# Altium project e-puck3-coreboard.PrjPcb (part 2 of 4)

## Sheet Power.SchDoc: Power
size A3; Organization: Use Organization_Name in ProjParam; Address1: Eliot Ferragni; Address2: STI-MOBOTS; Address3: EPFL; Address4: CH-1015 LAUSANNE; DocumentNumber: 4; Revision: A; SheetNumber: 4; SheetTotal: 11; ApprovedBy: Init ApprovedBy in DocParam; CheckedBy: Init CheckedBy in DocParam; Author: Init Author in DocParam; CompanyName: Init CompanyName in DocParam; DrawnBy: Init DrawBy in DocParam; Engineer: Init Engineer in DocParam; Title2: Power button + 3V + 1.2V + alimentation measures; DocumentName: Init DocumentName in DocParam; ProjectName: Init ProjectName in DocParam
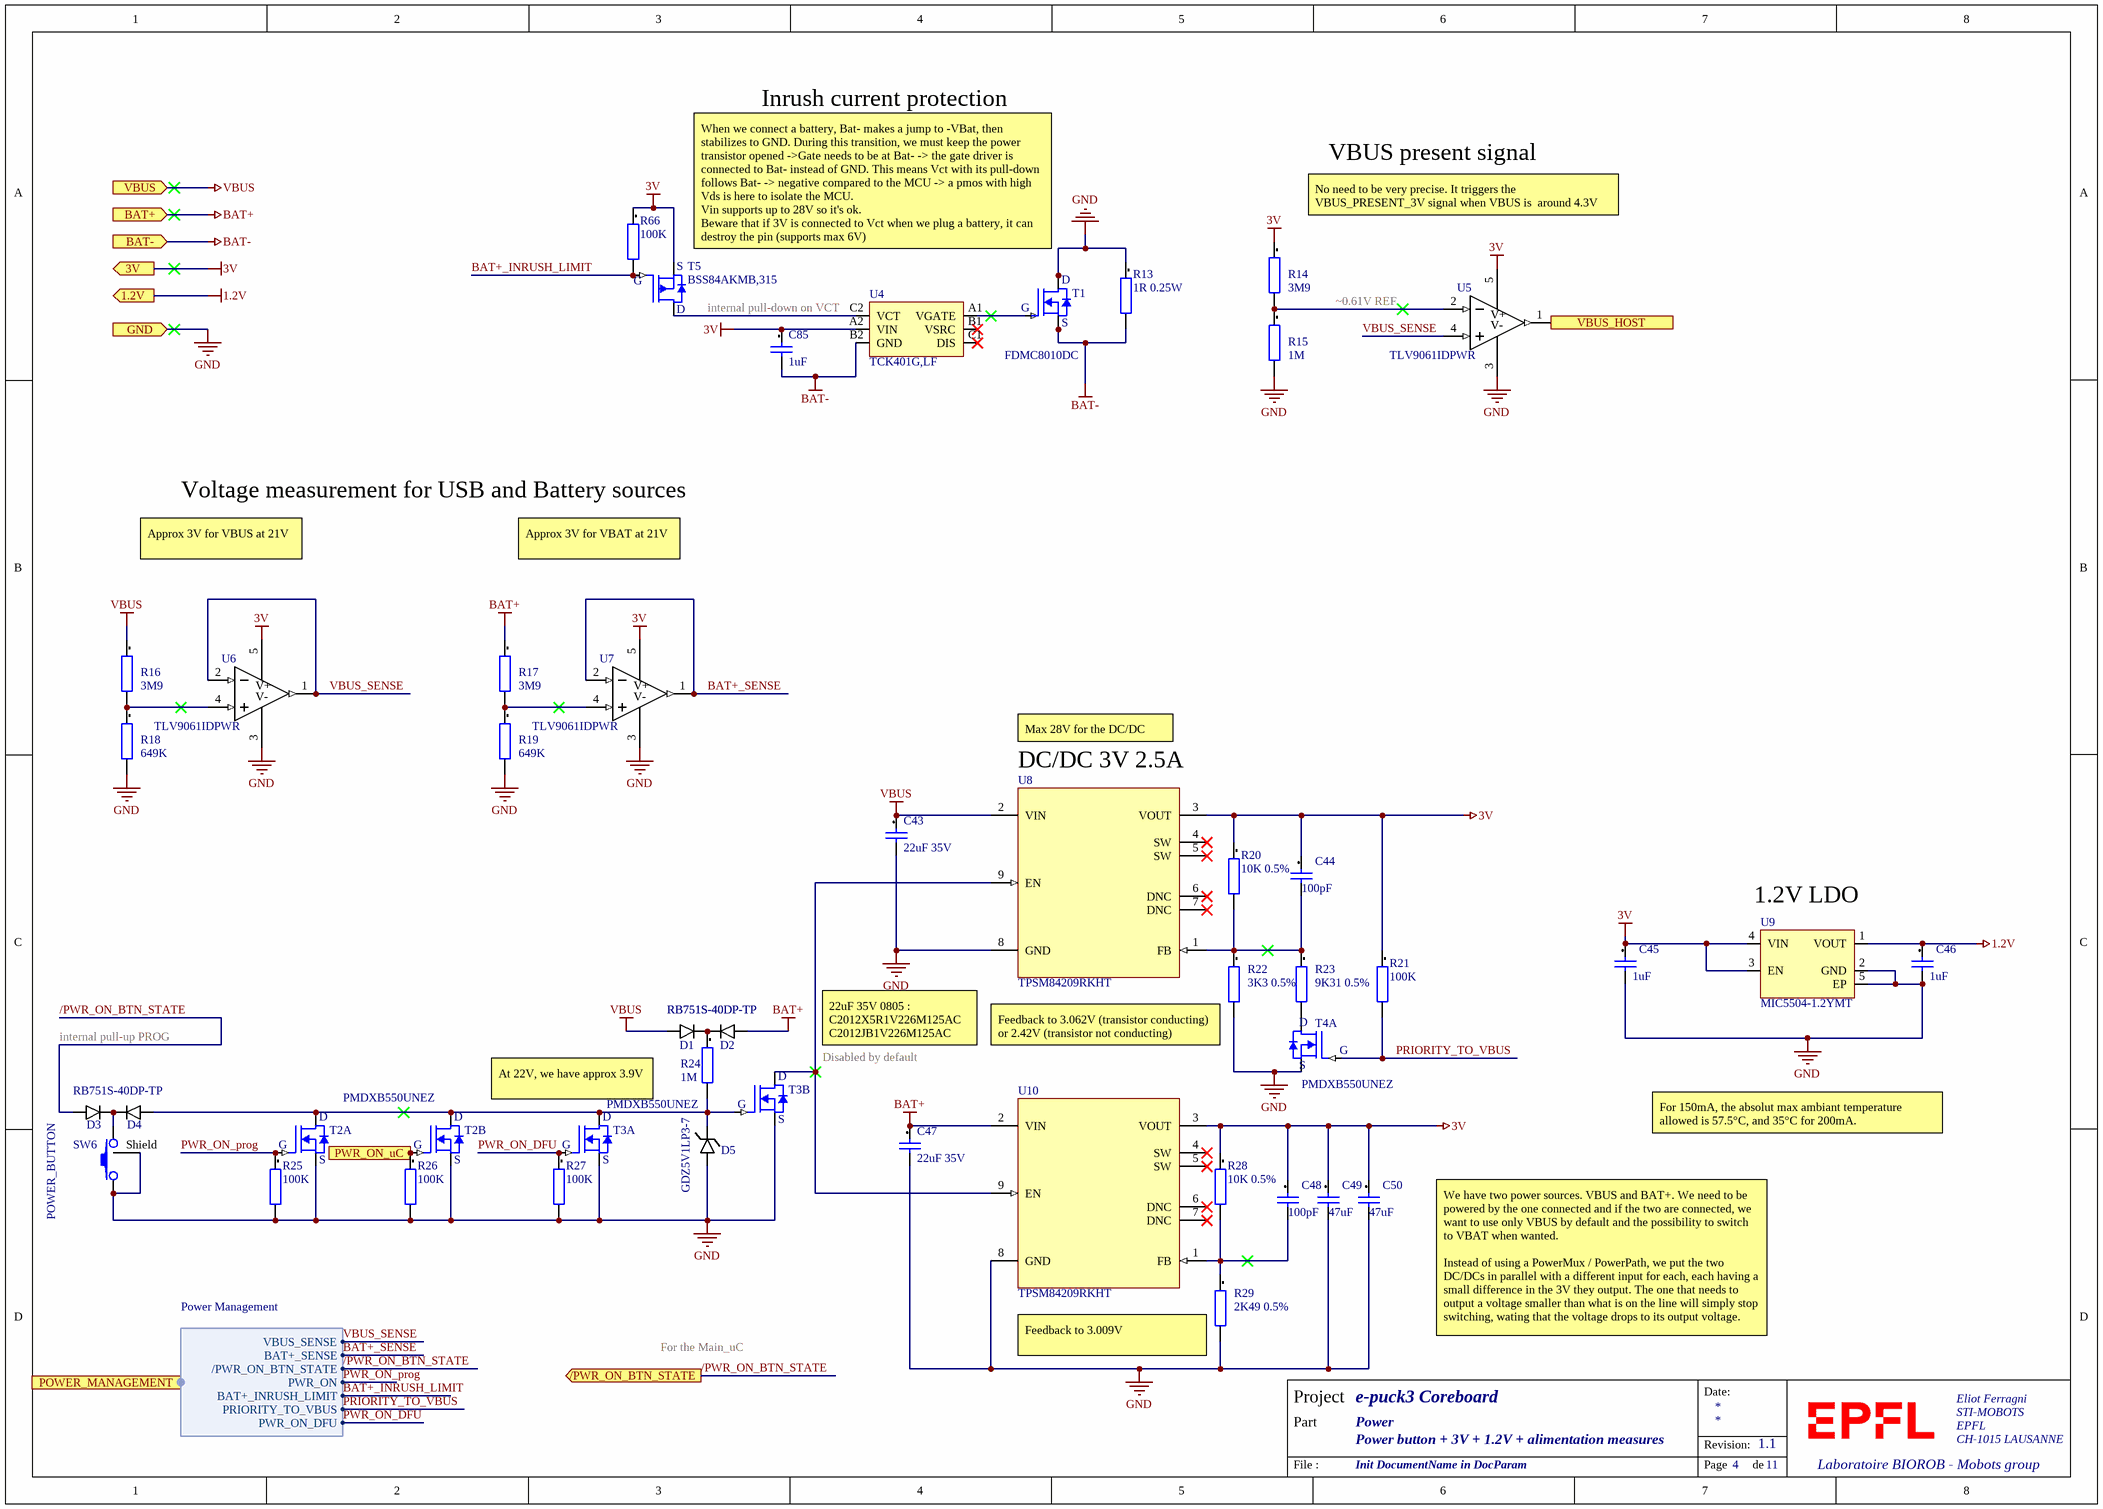
[diagram p2: Power.SchDoc]

### Parts
(Parts that share a designator on the sheet are numbered #1, #2 ... from top to bottom, then left to right.)
C43  22uF 35V  [CAPC2012X13L]
C44  100pF  [CAPC0201(0603)33_L]
C45  1uF  [CAPC0201(0603)33_L]
C46  1uF  [CAPC0201(0603)33_L]
C47  22uF 35V  [CAPC2012X13L]
C48  100pF  [CAPC0201(0603)33_L]
C49  47uF  [CAPC1608X08L]
C50  47uF  [CAPC1608X08L]
C85  1uF  [CAPC0201(0603)33_L]
D1#1  RB751S-40DP-TP  [0201 diode]
D2#1  RB751S-40DP-TP  [0201 diode]
D3#1  RB751S-40DP-TP  [0201 diode]  (value not drawn)
D4#1  RB751S-40DP-TP  [0201 diode]
D5#1  GDZ5V1LP3-7  [X3-DFN0603-2]
R13#1  1R 0.25W  [RESC1608X06L]
R14  3M9  [RESC0201(0603)_L]
R15  1M  [RESC0201(0603)_L]
R16  3M9  [RESC0201(0603)_L]
R17  3M9  [RESC0201(0603)_L]
R18  649K  [RESC0201(0603)_L]
R19  649K  [RESC0201(0603)_L]
R20  10K 0.5%  [RESC0201(0603)_L]
R21  100K  [RESC0201(0603)_L]
R22  3K3 0.5%  [RESC1005X04L]
R23  9K31 0.5%  [RESC1005X04L]
R24  1M  [RESC0201(0603)_L]
R25  100K  [RESC0201(0603)_L]
R26  100K  [RESC0201(0603)_L]
R27  100K  [RESC0201(0603)_L]
R28  10K 0.5%  [RESC0201(0603)_L]
R29  2K49 0.5%  [RESC1005X04L]
R66  100K  [RESC0201(0603)_L]
SW6  button  [C&K_KMR2]  (value not drawn)
T1  FDMC8010DC  [PQFN8 3.3X3.3]
T2  PMDXB550UNEZ  [DFN1010B-6]  (parts A,B of 2)
T3  PMDXB550UNEZ  [DFN1010B-6]  (parts A,B of 2)
T4  PMDXB550UNEZ  [DFN1010B-6]  (part A of 2)
T5  BSS84AKMB,315  [DFND1006B-3]
U4  TCK401G,LF  [WCSP6E]
U5  TLV9061IDPWR  [X2SON-5]
U6  TLV9061IDPWR  [X2SON-5]
U7  TLV9061IDPWR  [X2SON-5]
U8  TPSM84209RKHT  [QFN-FCMOD (RKH) 9]
U9  Manufacturer Part Number: MIC5504-1.2YMT  [TDFN-4]  (hidden comment: MIC5504-1.2YMT-TR)
U10  TPSM84209RKHT  [QFN-FCMOD (RKH) 9]

### Ports
1.2V (out), 3V (out), /PWR_ON_BTN_STATE (out), BAT+ (in), BAT- (in), GND (in), POWER_MANAGEMENT (harness Power Management), PWR_ON_uC (in), VBUS (in), VBUS_HOST (out)

### Harnesses
Power Management: VBUS_SENSE, BAT+_SENSE, /PWR_ON_BTN_STATE, PWR_ON, BAT+_INRUSH_LIMIT, PRIORITY_TO_VBUS, PWR_ON_DFU

### Nets
1.2V: C46.1 U9.1(VOUT) ; port 1.2V
3V: C44.1 C45.1 C48.1 C49.1 C50.1 C85.1 R14.1 R20.1 R21.1 R28.1 R66.1 T5.2(S) U4.A2(VIN) U5.5(VCC) U6.5(VCC) U7.5(VCC) U8.3(VOUT) U9.3(EN) U9.4(VIN) U10.3(VOUT) ; port 3V
BAT+: C47.1 D2#1.1(C) R17.1 U10.2(VIN) ; port BAT+
BAT-: C85.2 R13#1.2 T1.1(S) T1.2(S) T1.3(S) U4.B2(GND) ; port BAT-
GND: C43.2 C45.2 C46.2 C47.2 C49.2 C50.2 D5#1.2(C) R13#1.1 R15.2 R18.2 R19.2 R22.2 R25.2 R26.2 R27.2 R29.2 SW6.1 SW6.Shield T1.5(D) T1.6(D) T1.7(D) T1.8(D) T1.9(D) T2.1(S) T2.4(S) T3.1(S) T3.4(S) T4.1(S) U5.3(VEE) U6.3(VEE) U7.3(VEE) U8.8(GND) U9.2(GND) U9.5(EP) U10.8(GND) ; port GND
VBUS: C43.1 D1#1.1(C) R16.1 U8.2(VIN) ; port VBUS
/PWR_ON_BTN_STATE: D3#1.1(C) ; port /PWR_ON_BTN_STATE, port POWER_MANAGEMENT./PWR_ON_BTN_STATE
BAT+_INRUSH_LIMIT: R66.2 T5.1(G) ; port POWER_MANAGEMENT.BAT+_INRUSH_LIMIT  [project net POWER_MANAGEMENT.BAT+_INRUSH_LIMIT]
BAT+_SENSE: U7.1(OUT) U7.2(IN-) ; port POWER_MANAGEMENT.BAT+_SENSE  [project net POWER_MANAGEMENT.BAT+_SENSE]
PRIORITY_TO_VBUS: R21.2 T4.2(G) ; port POWER_MANAGEMENT.PRIORITY_TO_VBUS  [project net POWER_MANAGEMENT.PRIORITY_TO_VBUS]
PWR_ON: R26.1 T2.5(G) ; port PWR_ON_uC
PWR_ON_DFU: R27.1 T3.2(G) ; port POWER_MANAGEMENT.PWR_ON_DFU  [project net POWER_MANAGEMENT.PWR_ON_DFU]
PWR_ON_prog: R25.1 T2.2(G) ; port POWER_MANAGEMENT.PWR_ON  [project net POWER_MANAGEMENT.PWR_ON]
VBUS_HOST: U5.1(OUT) ; port VBUS_HOST
VBUS_SENSE: U5.4(IN+) U6.1(OUT) U6.2(IN-) ; port POWER_MANAGEMENT.VBUS_SENSE  [project net POWER_MANAGEMENT.VBUS_SENSE]
NetC44_2: C44.2 R20.2 R22.1 R23.1 U8.1(FB)
NetC48_2: C48.2 R28.2 R29.1 U10.1(FB)
NetD1#1_2: D1#1.2(C) D2#1.2(C) R24.1
NetD3#1_2: D3#1.2(C) D4#1.2(C) SW6.2
NetD4#1_1: D4#1.1(C) D5#1.1(C) R24.2 T2.3(D) T2.6(D) T3.5(G) T3.6(D)
NetR14_2: R14.2 R15.1 U5.2(IN-)
NetR16_2: R16.2 R18.1 U6.4(IN+)
NetR17_2: R17.2 R19.1 U7.4(IN+)
NetR23_2: R23.2 T4.6(D)
NetT1_4: T1.4(G) U4.A1(VGATE)
NetT3_3: T3.3(D) U8.9(EN) U10.9(EN)
NetT5_3: T5.3(D) U4.C2(VCT)

Not connected (* = marked no-connect by the designer): U4 B1(VSRC)* C1(DIS)*; U8 4(SW)* 5(SW)* 6(DNC)* 7(DNC)*; U10 4(SW)* 5(SW)* 6(DNC)* 7(DNC)*

### Notes on the sheet
- Inrush current protection
- VBUS present signal
- When we connect a battery, Bat- makes a jump to -VBat, then stabilizes to GND. During this transition, we must keep the power transistor opened ->Gate needs to be at Bat- -> the gate driver is connected to Bat- instead of GND. This means Vct with its pull-down follows Bat- -> negative compared to the MCU -> a pmos with high Vds is here to isolate the MCU.
  Vin supports up to 28V so it's ok.
  Beware that if 3V is connected to Vct when we plug a battery, it can destroy the pin (supports max 6V)
- No need to be very precise. It triggers the VBUS_PRESENT_3V signal when VBUS is  around 4.3V
- (near U4) internal pull-down on VCT
- ~0.61V REF
- Voltage measurement for USB and Battery sources
- Approx 3V for VBUS at 21V
- Approx 3V for VBAT at 21V
- (near U8) DC/DC 3V 2.5A
- Max 28V for the DC/DC
- (near U9) 1.2V LDO
- internal pull-up PROG
- 22uF 35V 0805 :
  C2012X5R1V226M125AC
  C2012JB1V226M125AC
- (near R22) Feedback to 3.062V (transistor conducting) or 2.42V (transistor not conducting)
- At 22V, we have approx 3.9V
- Disabled by default
- For 150mA, the absolut max ambiant temperature allowed is 57.5°C, and 35°C for 200mA.
- POWER_BUTTON
- For the Main_uC
- (near R29) Feedback to 3.009V
- We have two power sources. VBUS and BAT+. We need to be powered by the one connected and if the two are connected, we want to use only VBUS by default and the possibility to switch to VBAT when wanted.
  Instead of using a PowerMux / PowerPath, we put the two DC/DCs in parallel with a different input for each, each having a small difference in the 3V they output. The one that needs to output a voltage smaller than what is on the line will simply stop switching, wating that the voltage drops to its output voltage.
- Date:
- Project
- Part
- Revision:
- File :
- Page
- de
- (in symbol TLV9061IDPWR) V+; V-

### Library data of the parts
C43 C47 = TBD Capacitor[[/\]]0805[[/\]]1: Capacitor 0805; Manufacturer: TDK; Manufacturer part number: C2012X5R1V226M125AC; Preference: 1; Currentie: CHF; Type: SMD; Note: To buy by assembler; Size: 0805; Footprint Acort: 0805_G; ROHS: True; DateLastUpdate: 2012-11-19 / 14:37:26; Package / Case: Capacitor 0805
C44-C46 C48 C85 = TBD Capacitor[[/\]]0201[[/\]]1: as C20 on sheet Programmer; Size: 0201; Footprint Acort: 0201; ROHS: True; DateLastUpdate: 2018-10-19 / 8:59:52 AM; Manufacturer: -; Manufacturer part number: -; Package / Case: Capacitor 0201
C49 C50 = TBD Capacitor[[/\]]0603[[/\]]1: Capacitor 0603; Preference: 1; Currentie: CHF; Type: SMD; Note: To buy by assembler; Size: 0603; Footprint Acort: 0603_G; ROHS: True; DateLastUpdate: 2012-11-19 / 14:36:40; Manufacturer: -; Manufacturer part number: -; Package / Case: Capacitor 0603
D1#1 D2#1 D3#1 D4#1 = RB751S-40DP-TP: Schottky Diodes & Rectifiers 203 Package Schottky Diodes; Manufacturer: Micro Commercial Co; Reverse Voltage (DC): 28V; Average Rectified Current: 30mA; Element Configuration: Single; Forward Current: 200mA; Max Repetitive Reverse Voltage (Vrrm): 40V; Peak Reverse Current: 500nA; Max Power Dissipation: 100mW; Type: SMD; Note: To buy by assembler; Supplier 1: Digi-Key; Manufacturer Part Number: RB751S-40DP-TP; Stock 1: 104704; Pricing 1: 1=0.3, 10=0.27, 100=0.1514, 500=0.08112, 1000=0.05516 (USD); Mount: Surface Mount; Case/Package: 0201; Case Code (Metric): 0603; Case Code (Imperial): 0201; Max Operating Temperature: 125°C; Packaging: Tape and Reel; Termination: SMD/SMT; Max Forward Surge Current (Ifsm): 200mA; Package Quantity: 10000; Max Reverse Voltage (DC): 40V; Length: 0.67mm; Height: 0.34mm; Width: 0.37mm; Supplier Part Number 1: RB751S-40DP-TPMSCT-ND; Package / Case: Diode 0201
D5#1 = GDZ5V1LP3-7: DIODE ZENER 5.1V 250MW 2DFN; Manufacturer: Diodes Incorporated; Tolerance: 5%; Max Reverse Leakage Current: 200nA; Element Configuration: Single; Type: SMD; Note: To buy by assembler; Supplier 1: Digi-Key; Manufacturer Part Number: GDZ5V1LP3-7; Stock 1: 50190; Pricing 1: 1=0.37, 10=0.303, 100=0.1607, 500=0.1057, 1000=0.07188 (USD); Mount: Surface Mount; Case/Package: DFN; Number of Pins: 2; Min Operating Temperature: -55°C; Max Operating Temperature: 150°C; Packaging: Tape and Reel; Max Power Dissipation: 250mW; Package Quantity: 10000; Zener Voltage: 5.1V; Zener Current: 200nA; Voltage Tolerance: 5%; Peak Reverse Current: 200nA; Power Rating: 250mW; Length: 0.62mm; Height: 0.3mm; Width: 0.32mm; Radiation Hardening: No; REACH SVHC: No SVHC; ComponentLink1URL: https://www.diodes.com/assets/Datasheets/GDZxVxLP3.pdf; ComponentLink1Description: https://www.diodes.com/assets/Datasheets/GDZxVxLP3.pdf; Supplier Part Number 1: GDZ5V1LP3-7DICT-ND; Package / Case: X3-DFN0603-2
R13#1 = TBD[[/\]]0603[[/\]]1: Resistor 0603; Preference: 1; Currentie: CHF; Note: To buy by assembler; Size: 0603; Footprint Acort: 0603; ROHS: True; DateLastUpdate: 2012-11-19 / 14:13:33; Type: SMD; Manufacturer: -; Manufacturer part number: -; Package / Case: Resistor 0603
R14-R21 R24-R28 R66 = TBD[[/\]]0201[[/\]]1: as R1 on sheet Main; Size: 0201; Footprint Acort: 0201; ROHS: True; DateLastUpdate: 2018-10-19 / 9:06:49 AM; Type: SMD; Manufacturer: -; Manufacturer part number: -; Package / Case: Resistor 0201
R22 R23 R29 = TBD[[/\]]0402[[/\]]1: Resistor 0402; Preference: 1; Currentie: CHF; Note: To buy by assembler; Size: 0402; Footprint Acort: 0402; ROHS: True; DateLastUpdate: 2012-11-19 / 14:13:38; Type: SMD; Manufacturer: -; Manufacturer part number: -; Package / Case: Resistor 0402
SW6 = C&K KMR2: KMR221GLFS; Manufacturer: C&K; Manufacturer Nr: 7-188275-6; Preference: 1; Currentie: CHF; Quant_1: 10; Quant_2: 900; Circuit: SPST-NO; Switch Function: Off-Mom; Contact Rating @ Voltage: 0.05A @ 32VDC; Actuator Type: Standard; Actuator Height off PCB, from Pins: 1.90mm; Actuator Orientation: Top Actuated; Outline: 4.60mm x 2.80mm; Illumination: Non-Illuminated; Operating Force: 200gf; Switch Travel: 0.25mm; Mechanical Life: 200,000 Cycles; Note: To buy by assembler; Footprint Acort: ToDefine; ComponentLink1Description: Datasheet; ComponentLink1URL: http://ecommas.tycoelectronics.com/commerce/DocumentDelivery/DDEController?Action=showdoc&DocId=Customer+Drawing%7F188275%7FR%7Fpdf%7FEnglish%7FC_188275_R.pdf; Supplier: Farnell; Supplier Nr: 1056234; ComponentLink2Description: Farnell link; ComponentLink2URL: http://fr.farnell.com/jsp/displayProduct.jsp?sku=1056234; ROHS: True; Type: SMD; Orientation: Vertical; DateLastUpdate: 2007-12-04 / 09:15:57; Price_1: 1,1; Price_2: 0,924; Supplier 1: Digi-Key; Manufacturer Part Number: KMR221GLFS; Category: Switches; Stock 1: 20549; Pricing 1: 1=0.51, 10=0.493, 25=0.484, 50=0.4656, 100=0.4017, 250=0.3652, 500=0.34694, 1000=0.2739 (USD); Packaging: Cut Tape (CT); Mounting Type: Surface Mount; Termination Style: Gull Wing; Illumination Voltage (Nominal): -; Illumination Type, Color: -; Ingress Protection: -; Features: Grounding Pin; Actuator Material: -; Operating Temperature: -40°C ~ 85°C; ComponentLink3URL: http://www.ck-components.com/index.php?module=media&action=Display&cmpref=14414&lang=en&width=&height=&format=&alt=; ComponentLink3Description: http://www.ck-components.com/index.php?module=media&action=Display&cmpref=14414&lang=en&width=&height=&format=&alt=; Supplier Part Number 1: 401-1427-1-ND; Package / Case: SMD Button
T1 = FDMC8010DC: Power transistor; Manufacturer: ON Semiconductor / Fairchild; Element Configuration: Dual; Type: SMD; Note: To buy by assembler; Supplier 1: Digi-Key; Manufacturer Part Number: FDMC8010DC; Stock 1: 36; Pricing 1: 1 = 1,29000, 10 = 1,15600, 100 = 0,90120, 500 = 0,74448, 1000 = 0,58774 (USD); RoHS: No; Mount: Surface Mount; Weight: 0.039g; Min Operating Temperature: -55°C; Max Operating Temperature: 150°C; Supplier Part Number 1: FDMC8010DCOSCT-ND; Package / Case: Dual Cool 33
T2-T4 = PMDXB550UNEZ: DUAL N-CHANNEL 30V; Manufacturer: NXP Semiconductors; Continuous Drain Current (ID): 590mA; Max Power Dissipation: 285mW; Rds On Max: 670mR; Input Capacitance: 30.3pF; FET Type: 2 N-Channel; Type: SMD; Note: To buy by assembler; Supplier 1: Digi-Key; Stock 1: 5582; Pricing 1: 1=0.48, 10=0.379, 100=0.2601, 500=0.17838, 1000=0.13379 (USD); Mount: Surface Mount; Min Operating Temperature: -55°C; Max Operating Temperature: 150°C; Drain to Source Voltage (Vdss): 30V; Packaging: Tape and Reel; Supplier Part Number 1: 1727-2277-1-ND; Manufacturer Part Number: PMDXB550UNEZ; Package / Case: DFN1010B-6
T5 = BSS84AKMB,315: MOSFET P-CH 50V 230MA 3DFN; Manufacturer: Nexperia; Supplier 1: Digi-Key; Manufacturer Part Number: BSS84AKMB,315; Stock 1: 17379; Pricing 1: 1 = 0,29000, 10 = 0,23700, 25 = 0,19800, 100 = 0,09680, 500 = 0,08074, 1000 = 0,05610, 2500 = 0,05214, 5000 = 0,04510 (USD); RoHS: No; ComponentLink1URL: https://assets.nexperia.com/documents/data-sheet/BSS84AKMB.pdf?src-supplier=Digi-Key; ComponentLink1Description: https://assets.nexperia.com/documents/data-sheet/BSS84AKMB.pdf?src-supplier=Digi-Key; Supplier Part Number 1: 1727-1264-1-ND
U4 = TCK401G,LF: Manufacturer: Toshiba; Note: To buy by assembler; Supplier 1: Digi-Key; Stock 1: 12722; Pricing 1: 1 = 0,62000, 10 = 0,54400, 25 = 0,51080, 100 = 0,41690, 250 = 0,38728, 500 = 0,32960, 1000 = 0,26368, 2500 = 0,23896 (USD); RoHS: No; Supplier Part Number 1: TCK401GLFCT-ND; Manufacturer Part Number: TCK401G,LF; Type: SMD; Package / Case: WSCSP6E
U5-U7 = TLV9061IDPWR: OPAMP; Manufacturer: Texas Instruments; Number of Channels: 1; Note: To buy by assembler; Supplier 1: Digi-Key; Stock 1: 1920; Pricing 1: 1 = 0,59000, 10 = 0,51700, 100 = 0,39610, 500 = 0,31312, 1000 = 0,25050 (USD); RoHS: No; Min Operating Temperature: -40°C; Max Operating Temperature: 125°C; ComponentLink1URL: http://www.ti.com/lit/ds/symlink/tlv9061.pdf?src-supplier=Farnell; ComponentLink1Description: http://www.ti.com/lit/ds/symlink/tlv9061.pdf?src-supplier=Farnell; ComponentLink2URL: http://www.ti.com/lit/ds/symlink/tlv9061.pdf?src-supplier=Digi-Key; ComponentLink2Description: http://www.ti.com/lit/ds/symlink/tlv9061.pdf?src-supplier=Digi-Key; Supplier Part Number 1: 296-49053-1-ND; Manufacturer Part Number: TLV9061IDPWR; Type: SMD; Package / Case: X2SON-5
U8 U10 = TPSM84209RKHT: DC DC CONVERTER 1.2-6V 15W; Manufacturer: Texas Instruments; Voltage - Input (Min): 4.5V; Voltage - Input (Max): 28V; Voltage - Output 1: 1.2 ~ 6 V; Current - Output (Max): 2.5A; Efficiency: 86.5%; Note: To buy by assembler; Supplier 1: Digi-Key; Manufacturer Part Number: TPSM84209RKHT; RoHS: Request Inventory Verification; Category: Power Supplies - Board Mount; Stock 1: 47; Pricing 1: 1=5.04, 10=4.53, 100=3.7117 (USD); Packaging: Cut Tape (CT); Part Status: Active; Type: SMD; Voltage - Output 2: -; Voltage - Output 3: -; Voltage - Output 4: -; Applications: ITE (Commercial); Features: OCP, OTP, UVLO; Operating Temperature: -40°C ~ 85°C (With Derating); Mounting Type: Surface Mount; Package / Case: QFN-FCMOD; Size / Dimension: 0.18" L x 0.16" W x 0.08" H (4.5mm x 4.0mm x 2.1mm); Supplier Device Package: 9-QFN-FCMOD (4.5x4); ComponentLink1URL: http://www.ti.com/lit/ds/symlink/tpsm84209.pdf; ComponentLink1Description: http://www.ti.com/lit/ds/symlink/tpsm84209.pdf
U9 = MIC5504-1.2YMT-TR: IC REG LINEAR 1.2V 300MA 4TDFN; Manufacturer: Microchip; Dropout Voltage: 160mV; Number of Regulators: 1; Min Current Limit: 400mA; Note: To buy by assembler; Supplier 1: Digi-Key; Stock 1: 2603; Pricing 1: 1 = 0,16000, 25 = 0,13400, 100 = 0,12360 (USD); RoHS: Yes; Mount: Surface Mount; Min Operating Temperature: -40°C; Max Operating Temperature: 125°C; Packaging: Tape and Reel; Output Voltage: 1.2V; Output Current: 300mA; ComponentLink1URL: http://www.microchip.com/mymicrochip/filehandler.aspx?ddocname=en580292&src-supplier=Digi-Key; ComponentLink1Description: http://www.microchip.com/mymicrochip/filehandler.aspx?ddocname=en580292&src-supplier=Digi-Key; Supplier Part Number 1: MIC5504-1.2YMT-CT-ND; Type: SMD; Package / Case: TDFN-4

## Sheet USB.SchDoc: USB interfaces
size A3; Organization: Use Organization_Name in ProjParam; Address1: Eliot Ferragni; Address2: STI-MOBOTS; Address3: EPFL; Address4: CH-1015 LAUSANNE; DocumentNumber: 7; Revision: A; SheetNumber: 7; SheetTotal: 11; ApprovedBy: Init ApprovedBy in DocParam; CheckedBy: Init CheckedBy in DocParam; Author: Init Author in DocParam; CompanyName: Init CompanyName in DocParam; DrawnBy: Init DrawBy in DocParam; Engineer: Init Engineer in DocParam; Title2: USB-C connector, USB-PD, Hub, protection, HS Phy; DocumentName: Init DocumentName in DocParam; ProjectName: Init ProjectName in DocParam
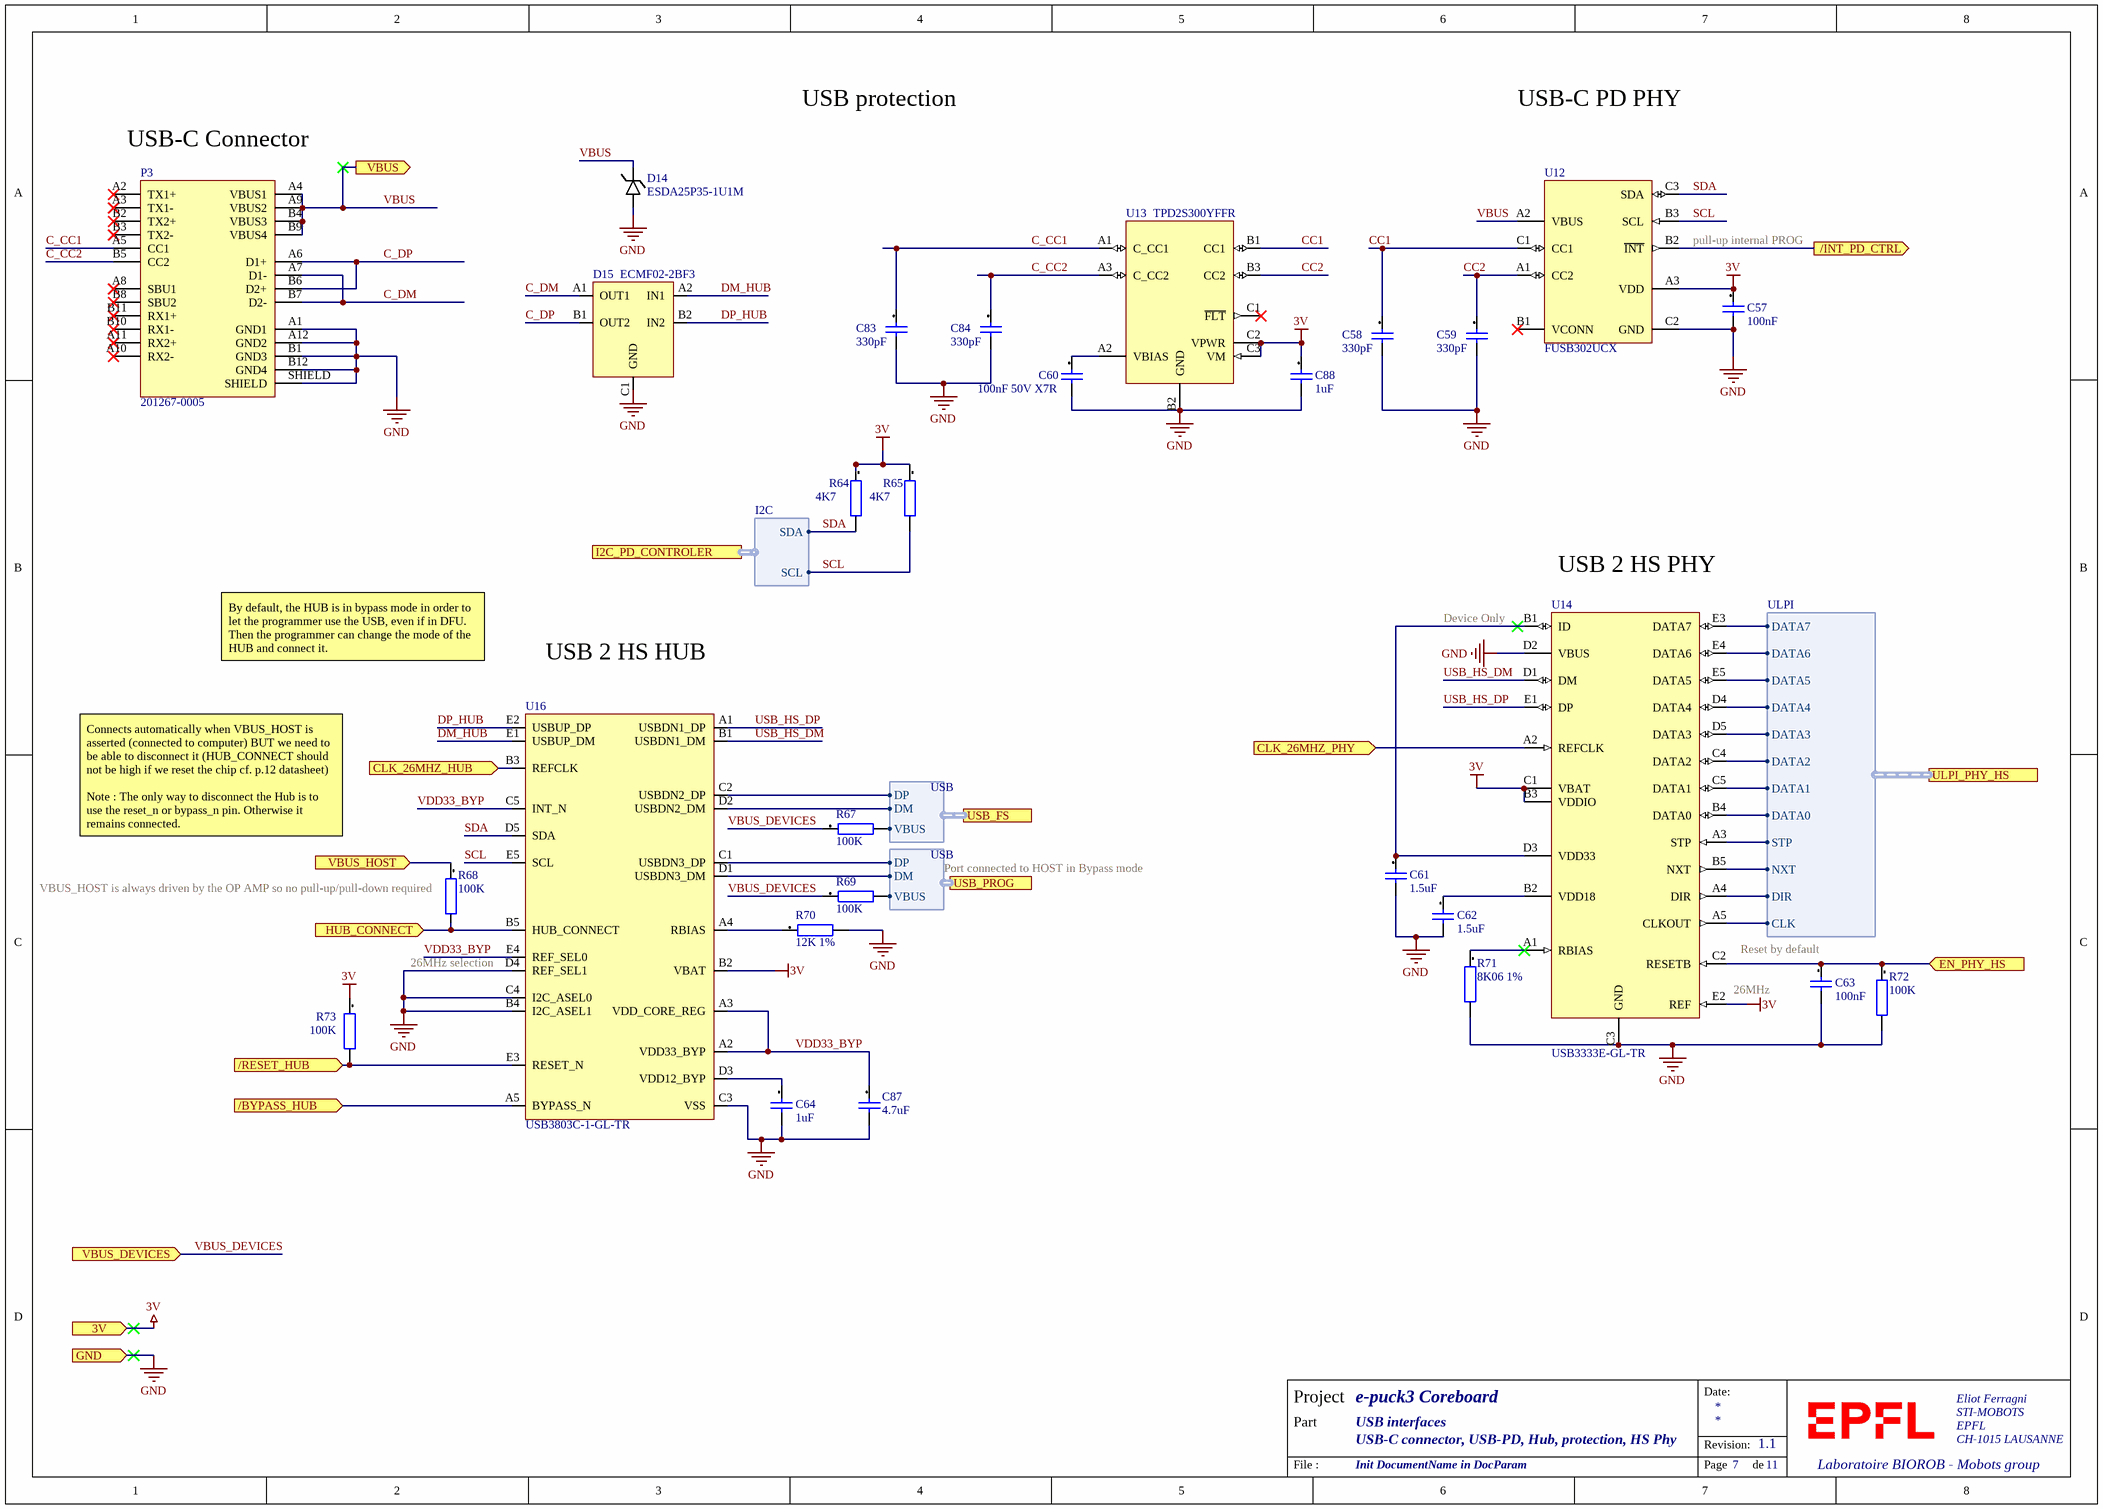
[diagram p3: USB.SchDoc]

### Parts
C57  100nF  [CAPC0201(0603)33_L]
C58  330pF  [CAPC0201(0603)33_L]
C59  330pF  [CAPC0201(0603)33_L]
C60  100nF 50V X7R  [CAPC1005X05L]
C61  1.5uF  [CAPC0201(0603)33_L]
C62  1.5uF  [CAPC0201(0603)33_L]
C63  100nF  [CAPC0201(0603)33_L]
C64  1uF  [CAPC0201(0603)33_L]
C83  330pF  [CAPC0201(0603)33_L]
C84  330pF  [CAPC0201(0603)33_L]
C87  4.7uF  [CAPC0201(0603)33_L]
C88  1uF  [CAPC0201(0603)33_L]
D14  ESDA25P35-1U1M  [0603 - diode]
D15  ECMF02-2BF3  [ECMF02-2BF3]
P3  201267-0005  [MOLEX_2012670005]
R64  4K7  [RESC0201(0603)_L]
R65  4K7  [RESC0201(0603)_L]
R67  100K  [RESC0201(0603)_L]
R68  100K  [RESC0201(0603)_L]
R69  100K  [RESC0201(0603)_L]
R70  12K 1%  [RESC0201(0603)_L]
R71  8K06 1%  [RESC0201(0603)_L]
R72  100K  [RESC0201(0603)_L]
R73  100K  [RESC0201(0603)_L]
U12  FUSB302UCX  [WLCSP9]
U13  TPD2S300YFFR  [WLCSP9 - ti]
U14  USB3333E-GL-TR  [25WLCSP]
U16  USB3803C-1-GL-TR  [25WLCSP]

### Ports
3V (in), /BYPASS_HUB (in), /INT_PD_CTRL (out), /RESET_HUB (in), CLK_26MHZ_HUB (in), CLK_26MHZ_PHY (in), EN_PHY_HS (in), GND (in), HUB_CONNECT (in), I2C_PD_CONTROLER (harness I2C), ULPI_PHY_HS (harness ULPI), USB_FS (harness USB), USB_PROG (harness USB), VBUS (out), VBUS_DEVICES (in), VBUS_HOST (in)

### Harnesses
USB: DM, DP, VBUS
ULPI: DATA7, DATA6, DATA5, DATA4, DATA3, DATA2, DATA1, DATA0, STP, NXT, DIR, CLK
I2C: SDA, SCL

### Nets
3V: C57.1 C88.1 R64.1 R65.1 R73.1 U12.A3(VDD) U13.C2(VPWR) U13.C3(VM) U14.B3(VDDIO) U14.C1(VBAT) U14.E2(REF) U16.B2(VBAT) ; port 3V
GND: C57.2 C58.2 C59.2 C60.2 C61.2 C62.2 C63.2 C64.2 C83.2 C84.2 C87.2 C88.2 D14.2(C) D15.C1(GND) P3.A1(GND1) P3.A12(GND2) P3.B1(GND3) P3.B12(GND4) P3.SHIELD R70.2 R71.2 R72.2 U12.C2(GND) U13.B2(GND) U14.C3(GND) U14.D2(VBUS) U16.B4(I2C_ASEL1) U16.C3(VSS) U16.C4(I2C_ASEL0) U16.D4(REF_SEL1) ; port GND
VBUS: D14.1(C) P3.A4(VBUS1) P3.A9(VBUS2) P3.B4(VBUS3) P3.B9(VBUS4) U12.A2(VBUS) ; port VBUS
26MHz_HUB_PROG: U16.B3(REFCLK) ; port CLK_26MHZ_HUB
26MHz_PHY_HS: U14.A2(REFCLK) ; port CLK_26MHZ_PHY
/BYPASS_HUB: U16.A5(BYPASS_N) ; port /BYPASS_HUB
/EN_PHY_HS: C63.1 R72.1 U14.C2(RESETB) ; port EN_PHY_HS
/INT_PD_CTRL: U12.B2(~{INT}) ; port /INT_PD_CTRL
/RESET_HUB: R73.2 U16.E3(RESET_N) ; port /RESET_HUB
C_CC1: C83.1 P3.A5(CC1) U13.A1(C_CC1)  [project net C_CC1_7]
C_CC2: C84.1 P3.B5(CC2) U13.A3(C_CC2)  [project net C_CC2_7]
C_DM: D15.A1(OUT1) P3.A7(D1-) P3.B7(D2-)  [project net C_DM_7]
C_DP: D15.B1(OUT2) P3.A6(D1+) P3.B6(D2+)  [project net C_DP_7]
CC1: C58.1 U12.C1(CC1) U13.B1(CC1)  [project net CC1_7]
CC2: C59.1 U12.A1(CC2) U13.B3(CC2)  [project net CC2_7]
DM_HUB: D15.A2(IN1) U16.E1(USBUP_DM)  [project net DM_HUB_7]
DP_HUB: D15.B2(IN2) U16.E2(USBUP_DP)  [project net DP_HUB_7]
HUB_CONNECT: R68.2 U16.B5(HUB_CONNECT) ; port HUB_CONNECT
SCL: R65.2 U12.B3(SCL) U16.E5(SCL) ; port I2C_PD_CONTROLER.SCL  [project net I2C_USB.SCL]
SDA: R64.2 U12.C3(SDA) U16.D5(SDA) ; port I2C_PD_CONTROLER.SDA  [project net I2C_USB.SDA]
USB_FS.DM: U16.D2(USBDN2_DM) ; port USB_FS.DM
USB_FS.DP: U16.C2(USBDN2_DP) ; port USB_FS.DP
USB_FS.VBUS: R67.2 ; port USB_FS.VBUS
USB_HS.CLK: U14.A5(CLKOUT) ; port ULPI_PHY_HS.CLK
USB_HS.DATA0: U14.B4(DATA0) ; port ULPI_PHY_HS.DATA0
USB_HS.DATA1: U14.C5(DATA1) ; port ULPI_PHY_HS.DATA1
USB_HS.DATA2: U14.C4(DATA2) ; port ULPI_PHY_HS.DATA2
USB_HS.DATA3: U14.D5(DATA3) ; port ULPI_PHY_HS.DATA3
USB_HS.DATA4: U14.D4(DATA4) ; port ULPI_PHY_HS.DATA4
USB_HS.DATA5: U14.E5(DATA5) ; port ULPI_PHY_HS.DATA5
USB_HS.DATA6: U14.E4(DATA6) ; port ULPI_PHY_HS.DATA6
USB_HS.DATA7: U14.E3(DATA7) ; port ULPI_PHY_HS.DATA7
USB_HS.DIR: U14.A4(DIR) ; port ULPI_PHY_HS.DIR
USB_HS.NXT: U14.B5(NXT) ; port ULPI_PHY_HS.NXT
USB_HS.STP: U14.A3(STP) ; port ULPI_PHY_HS.STP
USB_HS_DM: U14.D1(DM) U16.B1(USBDN1_DM)  [project net USB_HS_DM_7]
USB_HS_DP: U14.E1(DP) U16.A1(USBDN1_DP)  [project net USB_HS_DP_7]
USB_PROG.DM: U16.D1(USBDN3_DM) ; port USB_PROG.DM
USB_PROG.DP: U16.C1(USBDN3_DP) ; port USB_PROG.DP
USB_PROG.VBUS: R69.2 ; port USB_PROG.VBUS
VBUS_DEVICES: R67.1 R69.1 ; port VBUS_DEVICES
VBUS_HOST: R68.1 ; port VBUS_HOST
VDD33_BYP: C87.1 U16.A2(VDD33_BYP) U16.A3(VDD_CORE_REG) U16.C5(INT_N) U16.E4(REF_SEL0)  [project net VDD33_BYP_7]
NetC60_1: C60.1 U13.A2(VBIAS)
NetC61_1: C61.1 U14.B1(ID) U14.D3(VDD33)
NetC62_1: C62.1 U14.B2(VDD18)
NetC64_1: C64.1 U16.D3(VDD12_BYP)
NetR70_1: R70.1 U16.A4(RBIAS)
NetR71_1: R71.1 U14.A1(RBIAS)

Not connected (* = marked no-connect by the designer): P3 A2(TX1+)* A3(TX1-)* A8(SBU1)* A10(RX2-)* A11(RX2+)* B2(TX2+)* B3(TX2-)* B8(SBU2)* B10(RX1-)* B11(RX1+)*; U12 B1(VCONN)*; U13 C1(~{FLT})*

### Notes on the sheet
- USB protection
- USB-C PD PHY
- (near P3) USB-C Connector
- pull-up internal PROG
- (near U14) USB 2 HS PHY
- (near U14) Device Only
- By default, the HUB is in bypass mode in order to let the programmer use the USB, even if in DFU. Then the programmer can change the mode of the HUB and connect it.
- USB 2 HS HUB
- Connects automatically when VBUS_HOST is asserted (connected to computer) BUT we need to be able to disconnect it (HUB_CONNECT should not be high if we reset the chip cf. p.12 datasheet)
  Note : The only way to disconnect the Hub is to use the reset_n or bypass_n pin. Otherwise it remains connected.
- (near R68) VBUS_HOST is always driven by the OP AMP so no pull-up/pull-down required
- Port connected to HOST in Bypass mode
- (near U16) 26MHz selection
- (near U14) 26MHz
- (near C63) Reset by default
- Date:
- Project
- Part
- Revision:
- File :
- Page
- de

### Library data of the parts
C57-C59 C61-C64 C83 C84 C87 C88 = TBD Capacitor[[/\]]0201[[/\]]1: as C20 on sheet Programmer; Size: 0201; Footprint Acort: 0201; ROHS: True; DateLastUpdate: 2018-10-19 / 8:59:52 AM; Manufacturer: -; Manufacturer part number: -; Package / Case: Capacitor 0201
C60 = TBD Capacitor[[/\]]0402[[/\]]1: Capacitor 0402; Preference: 1; Currentie: CHF; Type: SMD; Note: To buy by assembler; Size: 0402; Footprint Acort: 0402; ROHS: True; DateLastUpdate: 2012-11-19 / 14:35:51; Manufacturer: -; Manufacturer part number: -; Package / Case: Capacitor 0402
D14 = ESDA25P35-1U1M: TVS DIODE 22V 41V 1610; Manufacturer: STMicroelectronics; Type: SMD; Note: To buy by assembler; Supplier 1: Digi-Key; Stock 1: 80; Pricing 1: 1 = 0,46000, 10 = 0,37300, 100 = 0,25380, 500 = 0,19034, 1000 = 0,14276, 2500 = 0,13086 (USD); RoHS: No; ComponentLink1URL: http://www.farnell.com/datasheets/2236209.pdf?src-supplier=Farnell; ComponentLink1Description: http://www.farnell.com/datasheets/2236209.pdf?src-supplier=Farnell; ComponentLink2URL: http://www.st.com/content/ccc/resource/technical/document/datasheet/group3/e4/43/53/b9/4e/8a/40/bb/DM00312034/files/DM00312034.pdf/jcr:content/translations/en.DM00312034.pdf?src-supplier=Digi-Key; ComponentLink2Description: http://www.st.com/content/ccc/resource/technical/document/datasheet/group3/e4/43/53/b9/4e/8a/40/bb/DM00312034/files/DM00312034.pdf/jcr:content/translations/en.DM00312034.pdf?src-supplier=Digi-Key; ComponentLink3URL: http://www.farnell.com/datasheets/2236209.pdf?src-supplier=Newark; ComponentLink3Description: http://www.farnell.com/datasheets/2236209.pdf?src-supplier=Newark; Supplier Part Number 1: 497-16913-1-ND; Manufacturer Part Number: ESDA25P35-1U1M; Package / Case: QFN 1610
D15 = ECMF02-2BF3: IC ESD FILTER COM MODE 5FLIPCHIP; Manufacturer: STMicroelectronics; Number of Lines: 2; Frequency: 2.2GHz; DC Resistance (DCR): 3R; Type: SMD; Note: To buy by assembler; Supplier 1: Digi-Key; Stock 1: 11040; Pricing 1: 1=0.65, 10=0.56, 100=0.4182, 500=0.32858, 1000=0.2539 (USD); Mount: Surface Mount; Case/Package: SMD/SMT; Min Operating Temperature: -40°C; Max Operating Temperature: 85°C; Package Quantity: 5000; Packaging: Tape and Reel; Termination: Flat; Radiation Hardening: No; Lead Free: Lead Free; ComponentLink1URL: http://www.st.com/st-web-ui/static/active/en/resource/technical/document/data_brief/DM00047758.pdf; ComponentLink1Description: http://www.st.com/st-web-ui/static/active/en/resource/technical/document/data_brief/DM00047758.pdf; ComponentLink2URL: http://www.st.com/content/ccc/resource/technical/document/data_brief/b5/64/4d/9e/10/b2/49/ce/DM00047758.pdf/files/DM00047758.pdf/jcr:content/translations/en.DM00047758.pdf; ComponentLink2Description: http://www.st.com/content/ccc/resource/technical/document/data_brief/b5/64/4d/9e/10/b2/49/ce/DM00047758.pdf/files/DM00047758.pdf/jcr:content/translations/en.DM00047758.pdf; Supplier Part Number 1: 497-12953-1-ND; Manufacturer Part Number: ECMF02-2BF3; Package / Case: Flip Chip 5 bumps
P3 = 201267-0005: USB Shielded I/O Receptacle; Type C; Right Angle; Surface Mount; Gold over Nickel; Manufacturer: Molex; Note: To buy by assembler; Supplier 1: Digi-Key; Stock 1: 7138; Pricing 1: 1=2.77, 10=2.531, 25=2.3876, 50=2.292, 100=2.1965, 250=2.00552, 500=1.86228 (USD); Supplier Part Number 1: WM17992CT-ND; Manufacturer Part Number: 201267-0005; Type: Hybrid; Package / Case: USB Connector
R64 R65 R67-R73 = TBD[[/\]]0201[[/\]]1: as R1 on sheet Main; Size: 0201; Footprint Acort: 0201; ROHS: True; DateLastUpdate: 2018-10-19 / 9:06:49 AM; Type: SMD; Manufacturer: -; Manufacturer part number: -; Package / Case: Resistor 0201
U12 = FUSB302UCX: USB Type-C Port Controller 9-Pin WLCSP T/R; Manufacturer: ON Semiconductor / Fairchild; Operating Supply Current: 25uA; Note: To buy by assembler; Supplier 1: Digi-Key; Stock 1: 0; Mount: Surface Mount; Number of Pins: 9; Weight: 0.0373333g; Contact Plating: Copper,Silver,Tin; Min Operating Temperature: -40°C; Max Operating Temperature: 85°C; Packaging: Tape and Reel; Interface: USB; Lead Free: Lead Free; Supplier Part Number 1: FUSB302UCXCT-ND; Manufacturer Part Number: FUSB302UCX; Type: SMD; Package / Case: WLCSP-9
U13 = TPD2S300YFFR: IC OVERVOLTAGE PROT CTRL 9DSBGA; Manufacturer: Texas Instruments; Interface: USB; Note: To buy by assembler; Supplier 1: Digi-Key; Stock 1: 1190; Pricing 1: 1=1.22, 10=1.094, 100=0.8532, 500=0.70482, 1000=0.55643 (USD); Min Operating Temperature: -40°C; Max Operating Temperature: 85°C; Supplier Part Number 1: 296-50034-1-ND; Manufacturer Part Number: TPD2S300YFFR; Type: SMD; Package / Case: DSBGA-9
U14 = USB3333E-GL-TR: IC TXRX USB 2.0 FLEXPWR 25WLCSP; Manufacturer: Microchip; Data Rate: 480Mbps; Note: To buy by assembler; Supplier 1: Digi-Key; Stock 1: 0; Pricing 1: 3000 = 1,47949 (USD); RoHS: Yes; Packaging: Tape and Reel; Package Quantity: 3000; ComponentLink1URL: https://datasheet.ciiva.com/6634/usb333x-6634538.pdf?src-supplier=Digi-Key; ComponentLink1Description: https://datasheet.ciiva.com/6634/usb333x-6634538.pdf?src-supplier=Digi-Key; Supplier Part Number 1: USB3333E-GL-TR-ND; Manufacturer Part Number: USB3333E-GL-TR; Type: SMD; Package / Case: 25WLCSP
U16 = USB3803C-1-GL-TR: IC HUB CTLR 3PORT USB 2.0 25CSP; Manufacturer: Microchip; Data Rate: 480Mbps; Min Supply Voltage: 1.2V; Operating Supply Voltage: 3.3V; Interface: USB,Serial; Max Supply Voltage: 3.6V; Number of Ports: 3; ESD Protection: Yes; USB Standard: USB 2.0; Supplier 1: Digi-Key; Stock 1: 0; Pricing 1: 3000 = 1,97266 (USD); RoHS: Yes; Mount: Surface Mount; Number of Pins: 25; Min Operating Temperature: 0°C; Max Operating Temperature: 70°C; Packaging: Tape and Reel; Package Quantity: 1; Number of Transceivers: 3; Length: 2mm; Height: 0.38mm; Width: 2mm; Radiation Hardening: No; REACH SVHC: No SVHC; Lead Free: Lead Free; ComponentLink1URL: https://datasheet.ciiva.com/18456/usb3803-18456930.pdf?src-supplier=Digi-Key; ComponentLink1Description: https://datasheet.ciiva.com/18456/usb3803-18456930.pdf?src-supplier=Digi-Key; ComponentLink2URL: https://datasheet.ciiva.com/6636/usb3803-6636271.pdf?src-supplier=Digi-Key; ComponentLink2Description: https://datasheet.ciiva.com/6636/usb3803-6636271.pdf?src-supplier=Digi-Key; Supplier Part Number 1: USB3803C-1-GL-TR-ND; Manufacturer Part Number: USB3803C-1-GL-TR

## Sheet Leds.SchDoc: LEDs
size A4; Organization: Use Organization_Name in ProjParam; Address1: EFI & DBR; Address2: STI-IMT-LSRO1; Address3: EPFL; Address4: CH-1015 LAUSANNE; DocumentNumber: 10; Revision: A; SheetNumber: 10; SheetTotal: 2; ApprovedBy: Init ApprovedBy in DocParam; CheckedBy: Init CheckedBy in DocParam; Author: Init Author in DocParam; CompanyName: Init CompanyName in DocParam; DrawnBy: Init DrawBy in DocParam; Engineer: Init Engineer in DocParam; DocumentName: Init DocumentName in DocParam; ProjectName: Init ProjectName in DocParam
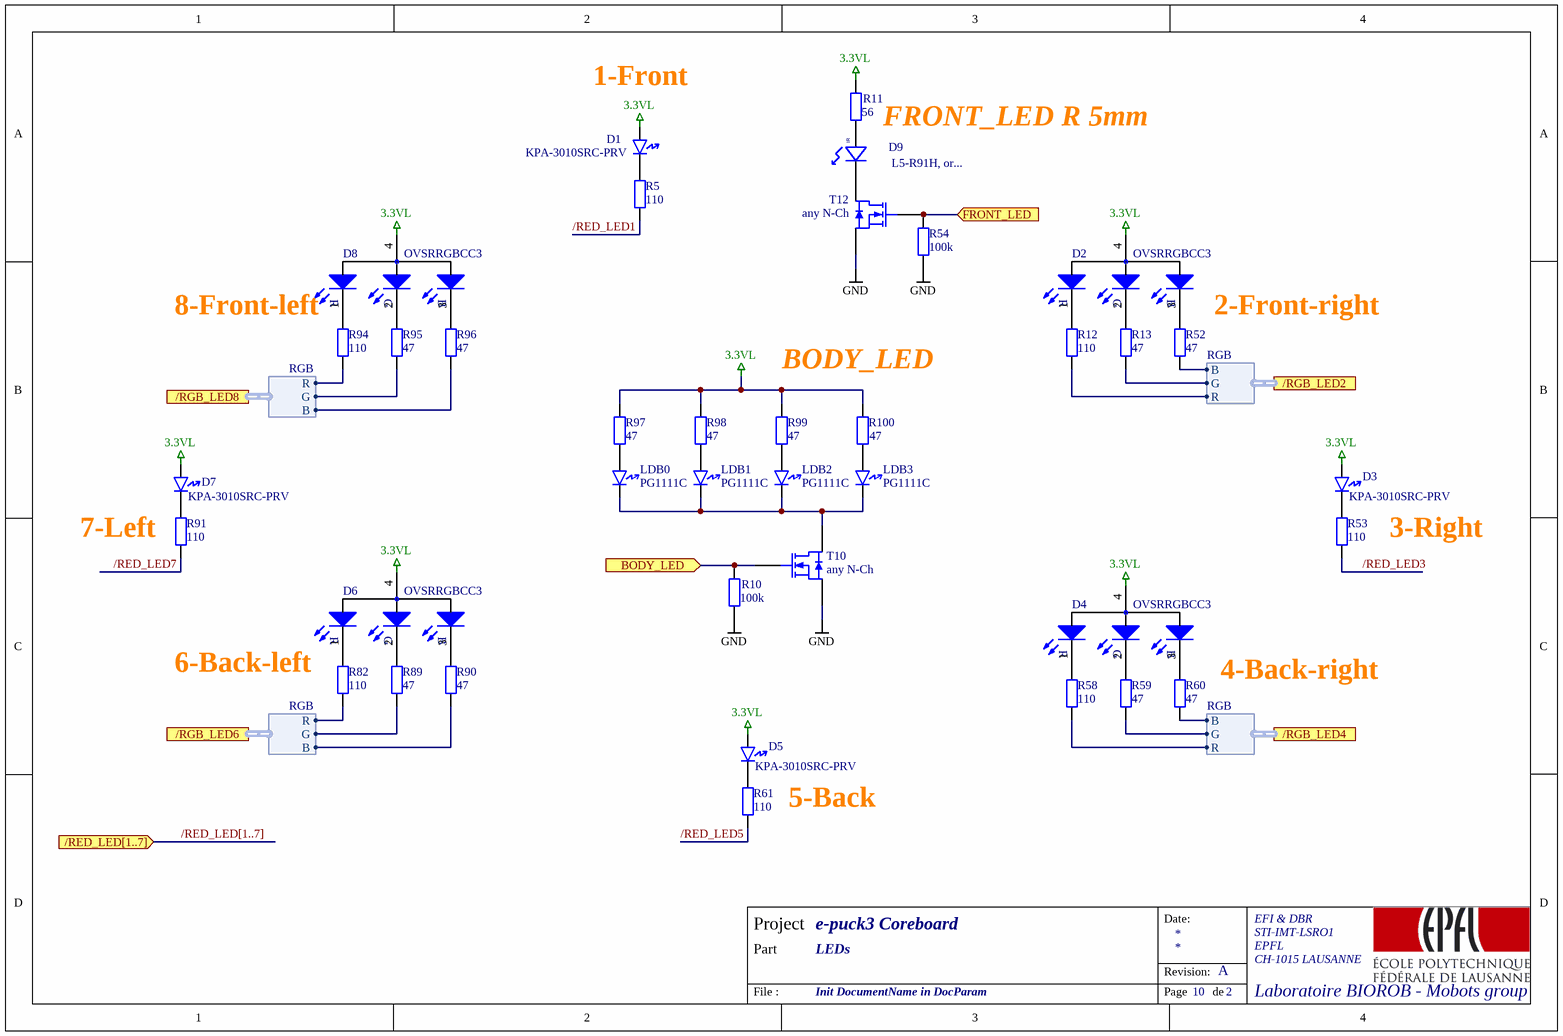
[diagram p4: Leds.SchDoc]

### Parts
(Parts that share a designator on the sheet are numbered #1, #2 ... from top to bottom, then left to right.)
D1#2  value KPA-3010SRC-PRV  [KPA-3010SRC-PRV]  (hidden comment: side LED Red)
D2#2  OVSRRGBCC3  [OVSRRGBCC3-Edge]
D3#2  value KPA-3010SRC-PRV  [KPA-3010SRC-PRV]  (hidden comment: side LED Red)
D4#2  OVSRRGBCC3  [OVSRRGBCC3-Edge]
D5#2  value KPA-3010SRC-PRV  [KPA-3010SRC-PRV]  (hidden comment: side LED Red)
D6  OVSRRGBCC3  [OVSRRGBCC3-Edge]
D7  value KPA-3010SRC-PRV  [KPA-3010SRC-PRV]  (hidden comment: side LED Red)
D8  OVSRRGBCC3  [OVSRRGBCC3-Edge]
D9  value L5-R91H, or...  [LED5_90]  (hidden comment: Led R 5mm)
LDB0  value PG1111C  [ROB_LED_0603]  (hidden comment: led green)
LDB1  value PG1111C  [ROB_LED_0603]  (hidden comment: led green)
LDB2  value PG1111C  [ROB_LED_0603]  (hidden comment: led green)
LDB3  value PG1111C  [ROB_LED_0603]  (hidden comment: led green)
R5#1  110  [ROB_0603]
R10#2  100k  [ROB_0603]
R11#2  56  [ROB_0603]
R12#2  110  [ROB_0603]
R13#2  47  [ROB_0603]
R52  47  [ROB_0603]
R53  110  [ROB_0603]
R54  100k  [ROB_0603]
R58  110  [ROB_0603]
R59  47  [ROB_0603]
R60  47  [ROB_0603]
R61  110  [ROB_0603]
R82#1  110  [ROB_0603]
R89  47  [ROB_0603]
R90  47  [ROB_0603]
R91  110  [ROB_0603]
R94  110  [ROB_0603]
R95  47  [ROB_0603]
R96  47  [ROB_0603]
R97  47  [ROB_0603]
R98  47  [ROB_0603]
R99  47  [ROB_0603]
R100  47  [ROB_0603]
T10  any N-Ch  [SOT23-3 - NEW]
T12  any N-Ch  [SOT23-3 - NEW]

### Ports
/RED_LED[1..7] (in), /RGB_LED2 (harness RGB), /RGB_LED4 (harness RGB), /RGB_LED6 (harness RGB), /RGB_LED8 (harness RGB), BODY_LED (in), FRONT_LED (in)

### Harnesses
RGB: R, G, B

### Nets
3.3VL: D1#2.2(A) D2#2.4(A) D3#2.2(A) D4#2.4(A) D5#2.2(A) D6.4(A) D7.2(A) D8.4(A) R11#2.1 R97.1 R98.1 R99.1 R100.1
GND: R10#2.2 R54.2 T10.2(S) T12.2(S)
/RED_LED1: R5#1.1  [project net /RED_LED1_10]
/RED_LED3: R53.1  [project net /RED_LED3_10]
/RED_LED5: R61.1  [project net /RED_LED5_10]
/RED_LED7: R91.1  [project net /RED_LED7_10]
NetD1#2_1: D1#2.1(K) R5#1.2
NetD2#2_1: D2#2.1(K) R12#2.2
NetD2#2_2: D2#2.2(K) R13#2.2
NetD2#2_3: D2#2.3(K) R52.2
NetD3#2_1: D3#2.1(K) R53.2
NetD4#2_1: D4#2.1(K) R58.2
NetD4#2_2: D4#2.2(K) R59.2
NetD4#2_3: D4#2.3(K) R60.2
NetD5#2_1: D5#2.1(K) R61.2
NetD6_1: D6.1(K) R82#1.2
NetD6_2: D6.2(K) R89.2
NetD6_3: D6.3(K) R90.2
NetD7_1: D7.1(K) R91.2
NetD8_1: D8.1(K) R94.2
NetD8_2: D8.2(K) R95.2
NetD8_3: D8.3(K) R96.2
NetD9_1: D9.1(A) R11#2.2
NetD9_2: D9.2(K) T12.3(D)
NetLDB0_1: LDB0.1(K) LDB1.1(K) LDB2.1(K) LDB3.1(K) T10.3(D)
NetLDB0_2: LDB0.2(A) R97.2
NetLDB1_2: LDB1.2(A) R98.2
NetLDB2_2: LDB2.2(A) R99.2
NetLDB3_2: LDB3.2(A) R100.2
NetR10#2_1: R10#2.1 T10.1(G) ; port BODY_LED
NetR12#2_1: R12#2.1 ; port /RGB_LED2.R
NetR13#2_1: R13#2.1 ; port /RGB_LED2.G
NetR52_1: R52.1 ; port /RGB_LED2.B
NetR54_1: R54.1 T12.1(G) ; port FRONT_LED
NetR58_1: R58.1 ; port /RGB_LED4.R
NetR59_1: R59.1 ; port /RGB_LED4.G
NetR60_1: R60.1 ; port /RGB_LED4.B
NetR82#1_1: R82#1.1 ; port /RGB_LED6.R
NetR89_1: R89.1 ; port /RGB_LED6.G
NetR90_1: R90.1 ; port /RGB_LED6.B
NetR94_1: R94.1 ; port /RGB_LED8.R
NetR95_1: R95.1 ; port /RGB_LED8.G
NetR96_1: R96.1 ; port /RGB_LED8.B

### Buses and harness runs
bus /RED_LED[1..7] = port /RED_LED[1..7]

### Notes on the sheet
- (near D1#2) 1-Front
- FRONT_LED R 5mm
- (near D8) 8-Front-left
- BODY_LED
- 2-Front-right
- (near R91) 7-Left
- 3-Right
- (near R82#1) 6-Back-left
- 4-Back-right
- 5-Back
- Date:
- Project
- Part
- Revision:
- File :
- Page
- de
- (in symbol LDIR_5MM) IR
- (in symbol OVSRRGBCC3) R; G; B

### Library data of the parts
D1#2 D3#2 D5#2 D7 = LED SMD: LED
D2#2 D4#2 D6 D8 = OVSRRGBCC3: side LED RGB SMD; Published: 8-Jun-2000; LatestRevisionDate: 08-Jul-2005; LatestRevisionNote: Mech Layer 1 removed.; PackageReference: OVSRRGBCC3; Publisher: Altium Limited; Value: OVSRRGBCC3
D9 = LDIR_5MM: strong red LED
LDB0-LDB3 = LED SMD: LED body
R5#1 R10#2 R11#2 R12#2 R13#2 R52-R54 R58-R61 R82#1 R89-R91 R94-R100 = Res2: Resistor; Published: 8-Jun-2000; LatestRevisionDate: 17-Jul-2002; LatestRevisionNote: Re-released for DXP Platform.; PackageReference: AXIAL-0.4; Publisher: Altium Limited
  R5#1 R12#2 R53 R58 R61 R82#1 R91 R94: Value: 110
  R10#2 R54: Value: 100k
  R11#2: Value: 56
  R13#2 R52 R59 R60 R89 R90 R95-R100: Value: 47
T10 T12 = IRLML6346TRPBF: N-Channel MOSFET Rds 0.063ohm@3.4A; PackageDocument: 1995/1996; Published: 8-Jun-2000; LatestRevisionDate: 17-Jul-2002; LatestRevisionNote: Re-released for DXP Platform.; PackageReference: E3; Publisher: Altium Limited; Value: any N-Ch

## Sheet Sensors + CAN.SchDoc: Sensors and CAN
size A4; Organization: Use Organization_Name in ProjParam; Address1: Eliot Ferragni; Address2: STI-MOBOTS; Address3: EPFL; Address4: CH-1015 LAUSANNE; DocumentNumber: 9; Revision: A; SheetNumber: 9; SheetTotal: 11; ApprovedBy: Init ApprovedBy in DocParam; CheckedBy: Init CheckedBy in DocParam; Author: Init Author in DocParam; CompanyName: Init CompanyName in DocParam; DrawnBy: Init DrawBy in DocParam; Engineer: Init Engineer in DocParam; Title2: IMU, dist., press. sensors, 4 Mics, CAN trans., IR rec.; DocumentName: Init DocumentName in DocParam; ProjectName: Init ProjectName in DocParam
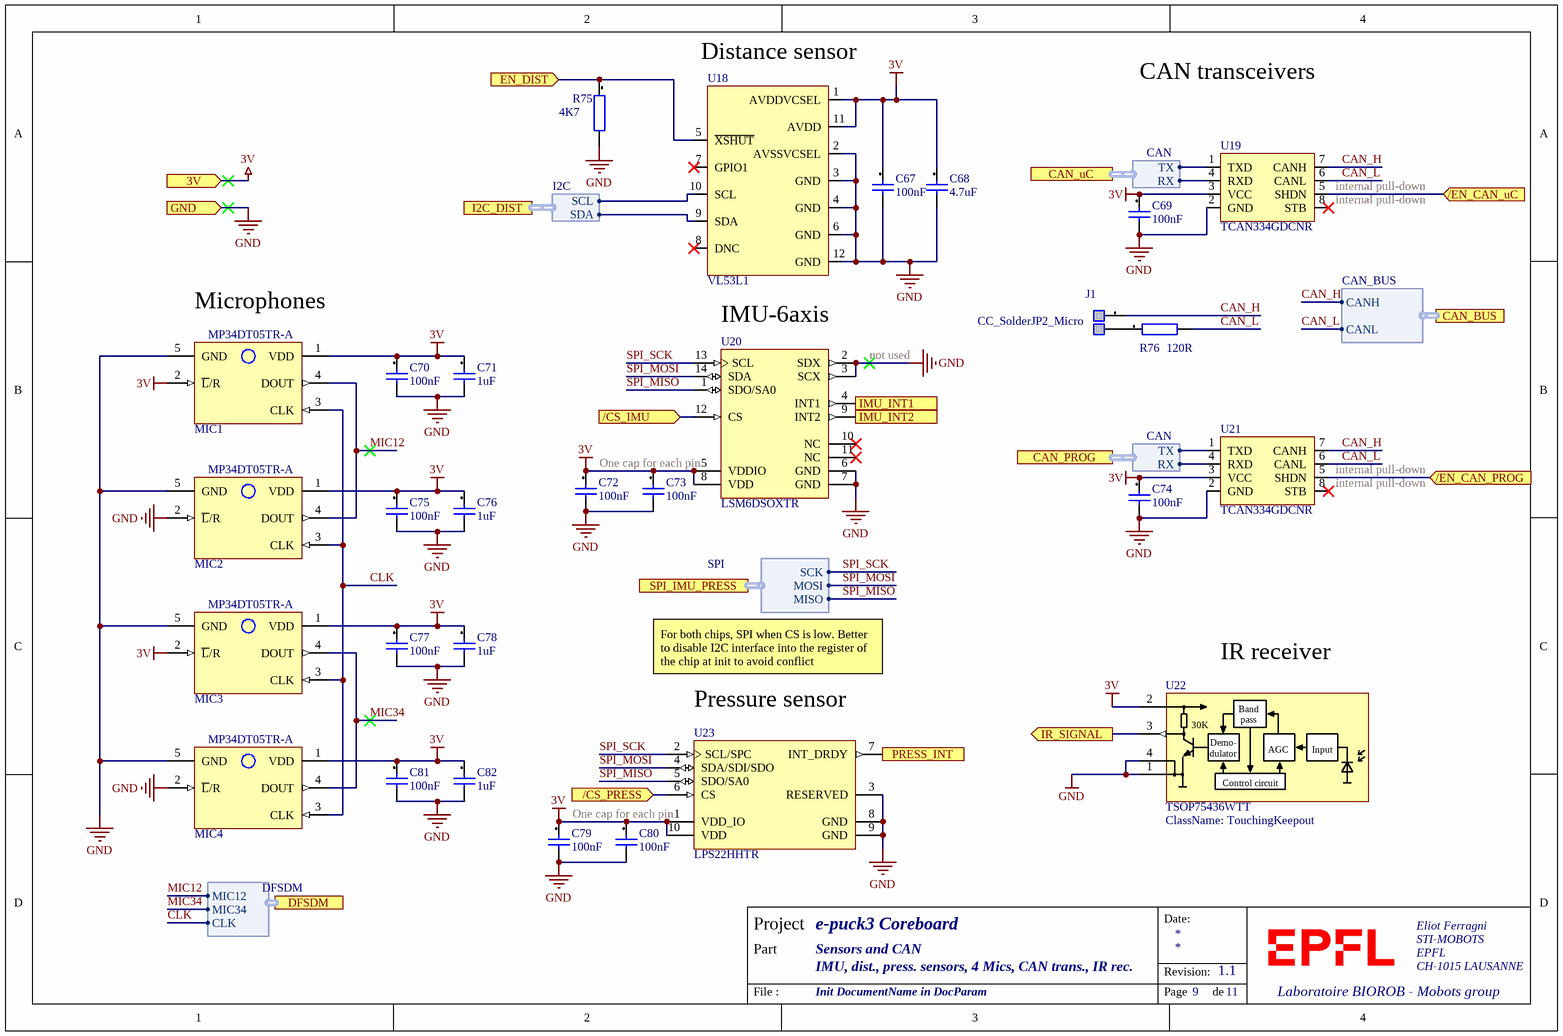
[diagram p5: Sensors + CAN.SchDoc]

### Parts
C67  100nF  [CAPC0201(0603)33_L]
C68  4.7uF  [CAPC0201(0603)33_L]
C69  100nF  [CAPC0201(0603)33_L]
C70  100nF  [CAPC0201(0603)33_L]
C71  1uF  [CAPC0201(0603)33_L]
C72  100nF  [CAPC0201(0603)33_L]
C73  100nF  [CAPC0201(0603)33_L]
C74  100nF  [CAPC0201(0603)33_L]
C75  100nF  [CAPC0201(0603)33_L]
C76  1uF  [CAPC0201(0603)33_L]
C77  100nF  [CAPC0201(0603)33_L]
C78  1uF  [CAPC0201(0603)33_L]
C79  100nF  [CAPC0201(0603)33_L]
C80  100nF  [CAPC0201(0603)33_L]
C81  100nF  [CAPC0201(0603)33_L]
C82  1uF  [CAPC0201(0603)33_L]
J1  CC_SolderJP2_Micro  [CC_SolderJP_U]  (no BOM)
MIC1  MP34DT05TR-A  [MIC-PACK_MP34DT05-A(Primary)]
MIC2  MP34DT05TR-A  [MIC-PACK_MP34DT05-A(Primary)]
MIC3  MP34DT05TR-A  [MIC-PACK_MP34DT05-A(Primary)]
MIC4  MP34DT05TR-A  [MIC-PACK_MP34DT05-A(Primary)]
R75  4K7  [RESC0201(0603)_L]
R76  120R  [RESC0201(0603)_L]
U18  VL53L1  [VL53L1x]
U19  TCAN334GDCNR  [SOT-23-8]
U20  LSM6DSOXTR  [STM_LGA_14L]
U21  TCAN334GDCNR  [SOT-23-8]
U22  TSOP75436WTT  ClassName: TouchingKeepout  [VISHAY-TSOP752-754]
U23  LPS22HHTR  [STM_HLGA_10L]

### Ports
3V (in), /CS_IMU (in), /CS_PRESS (in), /EN_CAN_PROG (in), /EN_CAN_uC (in), CAN_BUS (harness CAN_BUS), CAN_PROG (harness CAN), CAN_uC (harness CAN), DFSDM (harness DFSDM), EN_DIST (in), GND (in), I2C_DIST (harness I2C), IMU_INT1 (out), IMU_INT2 (out), IR_SIGNAL (out), PRESS_INT (out), SPI_IMU_PRESS (harness SPI)

### Harnesses
SPI: MISO, MOSI, SCK
CAN: TX, RX
CAN_BUS: CANH, CANL
DFSDM: MIC34, MIC12, CLK
I2C: SDA, SCL

### Nets
3V: C67.1 C68.1 C69.1 C70.1 C71.1 C72.1 C73.1 C74.1 C75.1 C76.1 C77.1 C78.1 C79.1 C80.1 C81.1 C82.1 MIC1.1(VDD) MIC1.2(~{L}/R) MIC2.1(VDD) MIC3.1(VDD) MIC3.2(~{L}/R) MIC4.1(VDD) U18.1(AVDDVCSEL) U18.11(AVDD) U19.3(VCC) U20.5(VDDIO) U20.8(VDD) U21.3(VCC) U22.2(VS) U23.1(VDD_IO) U23.10(VDD) ; port 3V
GND: C67.2 C68.2 C69.2 C70.2 C71.2 C72.2 C73.2 C74.2 C75.2 C76.2 C77.2 C78.2 C79.2 C80.2 C81.2 C82.2 MIC1.5(GND) MIC2.2(~{L}/R) MIC2.5(GND) MIC3.5(GND) MIC4.2(~{L}/R) MIC4.5(GND) R75.2 U18.2(AVSSVCSEL) U18.3(GND) U18.4(GND) U18.6(GND) U18.12(GND) U19.2(GND) U20.2(SDX) U20.3(SCX) U20.6(GND) U20.7(GND) U21.2(GND) U22.1(GND) U22.4(GND) U23.3(RESERVED) U23.8(GND) U23.9(GND) ; port GND
/CS_IMU: U20.12(CS) ; port /CS_IMU
/CS_PRESS: U23.6(CS) ; port /CS_PRESS
/EN_CAN_PROG: U21.5(SHDN) ; port /EN_CAN_PROG
/EN_CAN_uC: U19.5(SHDN) ; port /EN_CAN_uC
CAN1.RX: U19.4(RXD) ; port CAN_uC.RX
CAN1.TX: U19.1(TXD) ; port CAN_uC.TX
CAN_H: J1.1 U19.7(CANH) U21.7(CANH) ; port CAN_BUS.CANH  [project net CAN_BUS.CANH]
CAN_L: R76.2 U19.6(CANL) U21.6(CANL) ; port CAN_BUS.CANL  [project net CAN_BUS.CANL]
CAN_PROG.RX: U21.4(RXD) ; port CAN_PROG.RX
CAN_PROG.TX: U21.1(TXD) ; port CAN_PROG.TX
CLK: MIC1.3(CLK) MIC2.3(CLK) MIC3.3(CLK) MIC4.3(CLK) ; port DFSDM.CLK  [project net DFSDM.CLK]
EN_DIST: R75.1 U18.5(~{XSHUT}) ; port EN_DIST
I2C1.SCL: U18.10(SCL) ; port I2C_DIST.SCL
I2C1.SDA: U18.9(SDA) ; port I2C_DIST.SDA
IMU_INT1: U20.4(INT1) ; port IMU_INT1
IMU_INT2: U20.9(INT2) ; port IMU_INT2
IR_SIGNAL: U22.3(OUT) ; port IR_SIGNAL
MIC12: MIC1.4(DOUT) MIC2.4(DOUT) ; port DFSDM.MIC12  [project net DFSDM.MIC12]
MIC34: MIC3.4(DOUT) MIC4.4(DOUT) ; port DFSDM.MIC34  [project net DFSDM.MIC34]
PRESS_INT: U23.7(INT_DRDY) ; port PRESS_INT
SPI_MISO: U20.1(SDO/SA0) U23.5(SDO/SA0) ; port SPI_IMU_PRESS.MISO  [project net SPI2.MISO]
SPI_MOSI: U20.14(SDA) U23.4(SDA/SDI/SDO) ; port SPI_IMU_PRESS.MOSI  [project net SPI2.MOSI]
SPI_SCK: U20.13(SCL) U23.2(SCL/SPC) ; port SPI_IMU_PRESS.SCK  [project net SPI2.SCK]
NetJ1_2: J1.2 R76.1

Not connected (* = marked no-connect by the designer): U18 7(GPIO1)* 8(DNC)*; U19 8(STB)*; U20 10(NC)* 11(NC)*; U21 8(STB)*

### Notes on the sheet
- (near U18) Distance sensor
- CAN transceivers
- (near U19) internal pull-down
- (near MIC1) Microphones
- IMU-6axis
- (near U20) not used
- (near U20) One cap for each pin
- (near U21) internal pull-down
- For both chips, SPI when CS is low. Better to disable I2C interface into the register of the chip at init to avoid conflict
- (near U23) Pressure sensor
- IR receiver
- (near U23) One cap for each pin
- Date:
- Project
- Part
- Revision:
- File :
- Page
- de
- (in symbol TSOP75436WTT[[/\]]1) 30K; Band / pass; AGC; Input; Demo- / dulator; Control circuit

### Library data of the parts
C67-C82 = TBD Capacitor[[/\]]0201[[/\]]1: Capacitor 0201; Preference: 1; Currentie: CHF; Type: SMD; Note: To buy by assembler; Size: 0201; Footprint Acort: 0201; ROHS: True; DateLastUpdate: 2018-10-19 / 8:59:52 AM; Manufacturer: -; Manufacturer part number: -; Package / Case: Capacitor 0201
J1 = CC_SolderJP2_Micro: Micro Solder Jumper 2 leads; Preference: 1; Footprint Acort: ToDefine; DateLastUpdate: 2008-02-26 / 09:57:0; Type: SMD
MIC1-MIC4 = MP34DT05TR-A: MEMS AUD MIC SENSOR OMNI 4HCLGA; Manufacturer: STMicroelectronics; Output Type: Digital, PDM; Direction: Omnidirectional; Sensitivity: -26dB ±3dB @ 94dB SPL; S/N Ratio: 64dB; Port Location: Top; Shape: Rectangular; Note: To buy by assembler; Supplier 1: Digi-Key; Manufacturer Part Number: MP34DT05TR-A; RoHS: Request Inventory Verification; Category: Audio Products; Stock 1: 3088; Pricing 1: 1=1.41, 10=1.117, 100=0.8855, 500=0.7535, 1000=0.704 (USD); Packaging: Cut Tape (CT); Part Status: Active; Type: SMD; Ratings: -; Termination: Solder Pads; Height (Max): 0.043" (1.10mm); ComponentLink1URL: http://www.st.com/content/ccc/resource/technical/document/datasheet/group3/c7/90/d3/f6/b7/e7/40/c8/DM00415595/files/DM00415595.pdf/jcr:content/translations/en.DM00415595.pdf; ComponentLink1Description: http://www.st.com/content/ccc/resource/technical/document/datasheet/group3/c7/90/d3/f6/b7/e7/40/c8/DM00415595/files/DM00415595.pdf/jcr:content/translations/en.DM00415595.pdf; Supplier Part Number 1: 497-17809-1-ND; Package / Case: HCLGA-4LD
R75 R76 = TBD[[/\]]0201[[/\]]1: Resistor 0201; Preference: 1; Currentie: CHF; Note: To buy by assembler; Size: 0201; Footprint Acort: 0201; ROHS: True; DateLastUpdate: 2018-10-19 / 9:06:49 AM; Type: SMD; Manufacturer: -; Manufacturer part number: -; Package / Case: Resistor 0201
U18 = VL53L1CXV0FY/1_1: Time-of-Flight sensor, 4 - 400 cm distance, OPTICAL LGA12 4.9 x 2.5 x 1.56 mm, 940 nm laser (Class 1); Manufacturer: STMicroelectronics; Sensing Distance: 157.480" (4m); Output Type: I²C; Voltage - Supply: 2.6 V ~ 3.5 V; Note: To buy by assembler; Supplier 1: Digi-Key; Manufacturer Part Number: VL53L1CXV0FY/1; RoHS: Request Inventory Verification; Category: Sensors, Transducers; Stock 1: 12283; Pricing 1: 1=6.62, 10=5.979, 100=4.9502 (USD); Part Status: Active; Voltage - Output Difference (Typ) @ Distance: -; Voltage - Output (Typ) @ Distance: -; Operating Temperature: -20°C ~ 85°C (TA); Base Part Number: VL53L1X; ComponentLink1URL: http://www.st.com/content/ccc/resource/technical/document/datasheet/group3/7d/85/c8/95/fb/3b/4e/2d/DM00452094/files/DM00452094.pdf/jcr:content/translations/en.DM00452094.pdf; ComponentLink1Description: http://www.st.com/content/ccc/resource/technical/document/datasheet/group3/7d/85/c8/95/fb/3b/4e/2d/DM00452094/files/DM00452094.pdf/jcr:content/translations/en.DM00452094.pdf; Supplier Part Number 1: 497-17764-1-ND; Type: SMD; Package / Case: Optical LGA12
U19 U21 = TCAN334GDCNR: IC TXRX CAN 3.3V SOT23-8; Manufacturer: Texas Instruments; Note: To buy by assembler; Supplier 1: Digi-Key; Stock 1: 2700; Pricing 1: 1 = 2,76000, 10 = 2,48100, 100 = 2,03260, 500 = 1,73032, 1000 = 1,45930 (USD); RoHS: No; Min Operating Temperature: -40°C; Max Operating Temperature: 125°C; Lead Free: Lead Free; ComponentLink1URL: http://www.ti.com/lit/ds/symlink/tcan334.pdf?src-supplier=Digi-Key; ComponentLink1Description: http://www.ti.com/lit/ds/symlink/tcan334.pdf?src-supplier=Digi-Key; Supplier Part Number 1: 296-49939-1-ND; Manufacturer Part Number: TCAN334GDCNR; Type: SMD; Package / Case: SOT-23-8
U20 = LSM6DSOXTR: IMU 6-AXIS; Manufacturer: STMicroelectronics; Note: To buy by assembler; Supplier 1: Digi-Key; Stock 1: 2573; Pricing 1: 1 = 4,91000, 10 = 4,41300, 100 = 3,61530, 500 = 3,07764, 1000 = 2,59560 (USD); RoHS: No; Supplier Part Number 1: 497-18367-1-ND; Manufacturer Part Number: LSM6DSOXTR; Type: SMD; Package / Case: STM_LGA_14L
U22 = TSOP75436WTT[[/\]]1: Vishay 	TSOP75436WTT IR Receiver Modules for Remote Control Systems; Preference: 1; Quant_2: 50; Quant_3: 200; Currentie: CHF; Note: To buy by assembler; Size: TSOP752-754; Footprint Acort: ToDefine; ComponentLink1URL: http://www.vishay.com/docs/82496/tsop752w.pdf; ComponentLink1Description: Datasheet; Supplier: Farnell; Supplier Nr: 2251419; ComponentLink2Description: Farnell link; ComponentLink2URL: http://ch.farnell.com/fr-CH/vishay/tsop75436wtt/recepteur-ir-heimdall-agc4-36khz/dp/2251419; Manufacturer: Vishay; Manufacturer Nr: TSOP75436WTT; Quant_1: 1; Price_1: 1.144; Price_2: 1.056; Price_3: 0.924; ROHS: True; DateLastUpdate: 2014-11-27 / 08:18:45; Type: SMD; Manufacturer part number: TSOP75436WTT; Package / Case: SMD module
U23 = LPS22HHTR: Pressure Sensor; Manufacturer: STMicroelectronics; Note: To buy by assembler; Supplier 1: Digi-Key; Stock 1: 8271; Pricing 1: 1 = 3,50000, 10 = 3,14200, 100 = 2,57400, 500 = 2,19120, 1000 = 1,84800 (USD); RoHS: No; ComponentLink1URL: https://www.st.com/resource/en/datasheet/lps22hh.pdf?src-supplier=Digi-Key; ComponentLink1Description: https://www.st.com/resource/en/datasheet/lps22hh.pdf?src-supplier=Digi-Key; ComponentLink2URL: https://www.st.com/resource/en/data_brief/lps22hh.pdf?src-supplier=Digi-Key; ComponentLink2Description: https://www.st.com/resource/en/data_brief/lps22hh.pdf?src-supplier=Digi-Key; Supplier Part Number 1: 497-18182-1-ND; Manufacturer Part Number: LPS22HHTR; Type: SMD; Package / Case: STM_HLGA_10L

## Sheet Wireless.SchDoc: ESP32 Wireless module
size A4; Organization: Use Organization_Name in ProjParam; Address1: Eliot Ferragni; Address2: STI-MOBOTS; Address3: EPFL; Address4: CH-1015 LAUSANNE; DocumentNumber: 8; Revision: A; SheetNumber: 8; SheetTotal: 11; ApprovedBy: Init ApprovedBy in DocParam; CheckedBy: Init CheckedBy in DocParam; Author: Init Author in DocParam; CompanyName: Init CompanyName in DocParam; DrawnBy: Init DrawBy in DocParam; Engineer: Init Engineer in DocParam; Title2: WiFi + BT4.2/BLE + Xtensa dual core 600 DMips; DocumentName: Init DocumentName in DocParam; ProjectName: Init ProjectName in DocParam
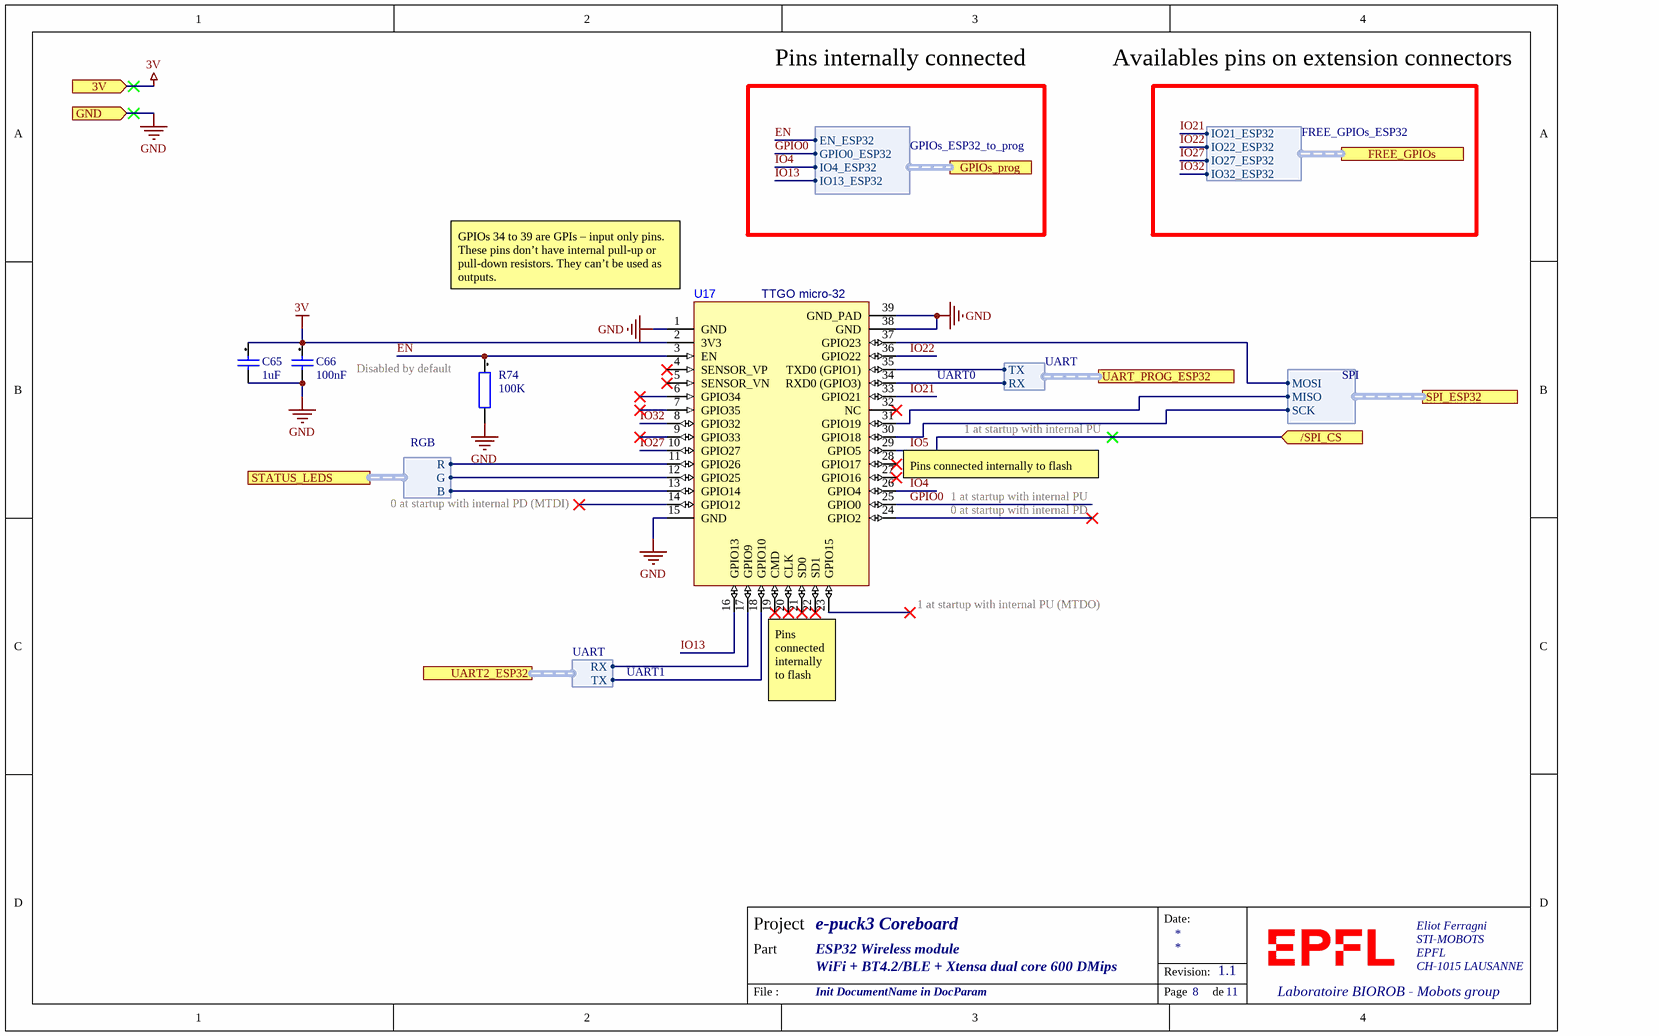
[diagram p6: Wireless.SchDoc]

### Parts
C65  1uF  [CAPC0201(0603)33_L]
C66  100nF  [CAPC0201(0603)33_L]
R74  100K  [RESC0201(0603)_L]
U17  PART NUMBER: TTGO micro-32  [TTGO Micro-32 (ESP32)]  (hidden comment: TTGO micro-32 (ESP32))

### Ports
3V (in), /SPI_CS (in), FREE_GPIOs (harness FREE_GPIOs_ESP32), GND (in), GPIOs_prog (harness GPIOs_ESP32_to_prog), SPI_ESP32 (harness SPI), STATUS_LEDS (harness RGB), UART2_ESP32 (harness UART), UART_PROG_ESP32 (harness UART)

### Harnesses
SPI: MISO, MOSI, SCK
UART: RX, TX
RGB: R, G, B
FREE_GPIOs_ESP32: IO22_ESP32, IO21_ESP32, IO27_ESP32, IO32_ESP32
GPIOs_ESP32_to_prog: IO4_ESP32, IO13_ESP32, GPIO0_ESP32, EN_ESP32

### Nets
3V: C65.1 C66.1 U17.2(3V3) ; port 3V
GND: C65.2 C66.2 R74.2 U17.1(GND) U17.15(GND) U17.38(GND) U17.39(GND_PAD) ; port GND
EN: R74.1 U17.3(EN) ; port GPIOs_prog.EN_ESP32  [project net GPIOs_ESP32.EN_ESP32]
GPIO0: U17.25(GPIO0) ; port GPIOs_prog.GPIO0_ESP32  [project net GPIOs_ESP32.GPIO0_ESP32]
IO4: U17.26(GPIO4) ; port GPIOs_prog.IO4_ESP32  [project net GPIOs_ESP32.IO4_ESP32]
IO5: U17.29(GPIO5) ; port /SPI_CS  [project net /SPI_ESP_CS]
IO13: U17.16(GPIO13) ; port GPIOs_prog.IO13_ESP32  [project net GPIOs_ESP32.IO13_ESP32]
IO21: U17.33(GPIO21) ; port FREE_GPIOs.IO21_ESP32  [project net FREE_GPIOs_ESP32.IO21_ESP32]
IO22: U17.36(GPIO22) ; port FREE_GPIOs.IO22_ESP32  [project net FREE_GPIOs_ESP32.IO22_ESP32]
IO27: U17.10(GPIO27) ; port FREE_GPIOs.IO27_ESP32  [project net FREE_GPIOs_ESP32.IO27_ESP32]
IO32: U17.8(GPIO32) ; port FREE_GPIOs.IO32_ESP32  [project net FREE_GPIOs_ESP32.IO32_ESP32]
SPI3.MISO: U17.31(GPIO19) ; port SPI_ESP32.MISO
SPI3.MOSI: U17.37(GPIO23) ; port SPI_ESP32.MOSI
SPI3.SCK: U17.30(GPIO18) ; port SPI_ESP32.SCK
STATUS4_RGB.B: U17.13(GPIO14) ; port STATUS_LEDS.B
STATUS4_RGB.G: U17.12(GPIO25) ; port STATUS_LEDS.G
STATUS4_RGB.R: U17.11(GPIO26) ; port STATUS_LEDS.R
UART2_ESP32.RX: U17.17(GPIO9) ; port UART2_ESP32.RX
UART2_ESP32.TX: U17.18(GPIO10) ; port UART2_ESP32.TX
UART_PROG_ESP32.RX: U17.34(RXD0_(GPIO3)) ; port UART_PROG_ESP32.RX
UART_PROG_ESP32.TX: U17.35(TXD0_(GPIO1)) ; port UART_PROG_ESP32.TX

Not connected (* = marked no-connect by the designer): U17 4(SENSOR_VP)* 5(SENSOR_VN)* 6(GPIO34)* 7(GPIO35)* 9(GPIO33)* 14(GPIO12)* 19(CMD)* 20(CLK)* 21(SD0)* 22(SD1)* 23(GPIO15)* 24(GPIO2)* 27(GPIO16)* 28(GPIO17)* 32(NC)*

### Notes on the sheet
- Pins internally connected
- Availables pins on extension connectors
- (near U17) GPIOs 34 to 39 are GPIs – input only pins. These pins don’t have internal pull-up or pull-down resistors. They can’t be used as outputs.
- (near R74) Disabled by default
- UART0
- 1 at startup with internal PU
- 0 at startup with internal PD (MTDI)
- (near U17) Pins connected internally to flash
- 0 at startup with internal PD
- (near U17) 1 at startup with internal PU (MTDO)
- UART1
- Date:
- Project
- Part
- Revision:
- File :
- Page
- de

### Library data of the parts
C65 C66 = TBD Capacitor[[/\]]0201[[/\]]1: as C67-C82 on sheet Sensors + CAN; Size: 0201; Footprint Acort: 0201; ROHS: True; DateLastUpdate: 2018-10-19 / 8:59:52 AM; Manufacturer: -; Manufacturer part number: -; Package / Case: Capacitor 0201
R74 = TBD[[/\]]0201[[/\]]1: as R75 on sheet Sensors + CAN; Size: 0201; Footprint Acort: 0201; ROHS: True; DateLastUpdate: 2018-10-19 / 9:06:49 AM; Type: SMD; Manufacturer: -; Manufacturer part number: -; Package / Case: Resistor 0201
U17 = TTGO micro-32 (ESP32): Wi-Fi BT BLE MCU Module; MANUFACTURER: LilyLGo; ESPRESSIF CHIP: esp32-pico-d4; Note: Provided by Customer; Type: SMD; Manufacturer part number: TTGO micro-32 (ESP32); Package / Case: SMD module